# Altium project ALCT_MEZ_SPARTAN6.PrjPcb (part 1 of 5)
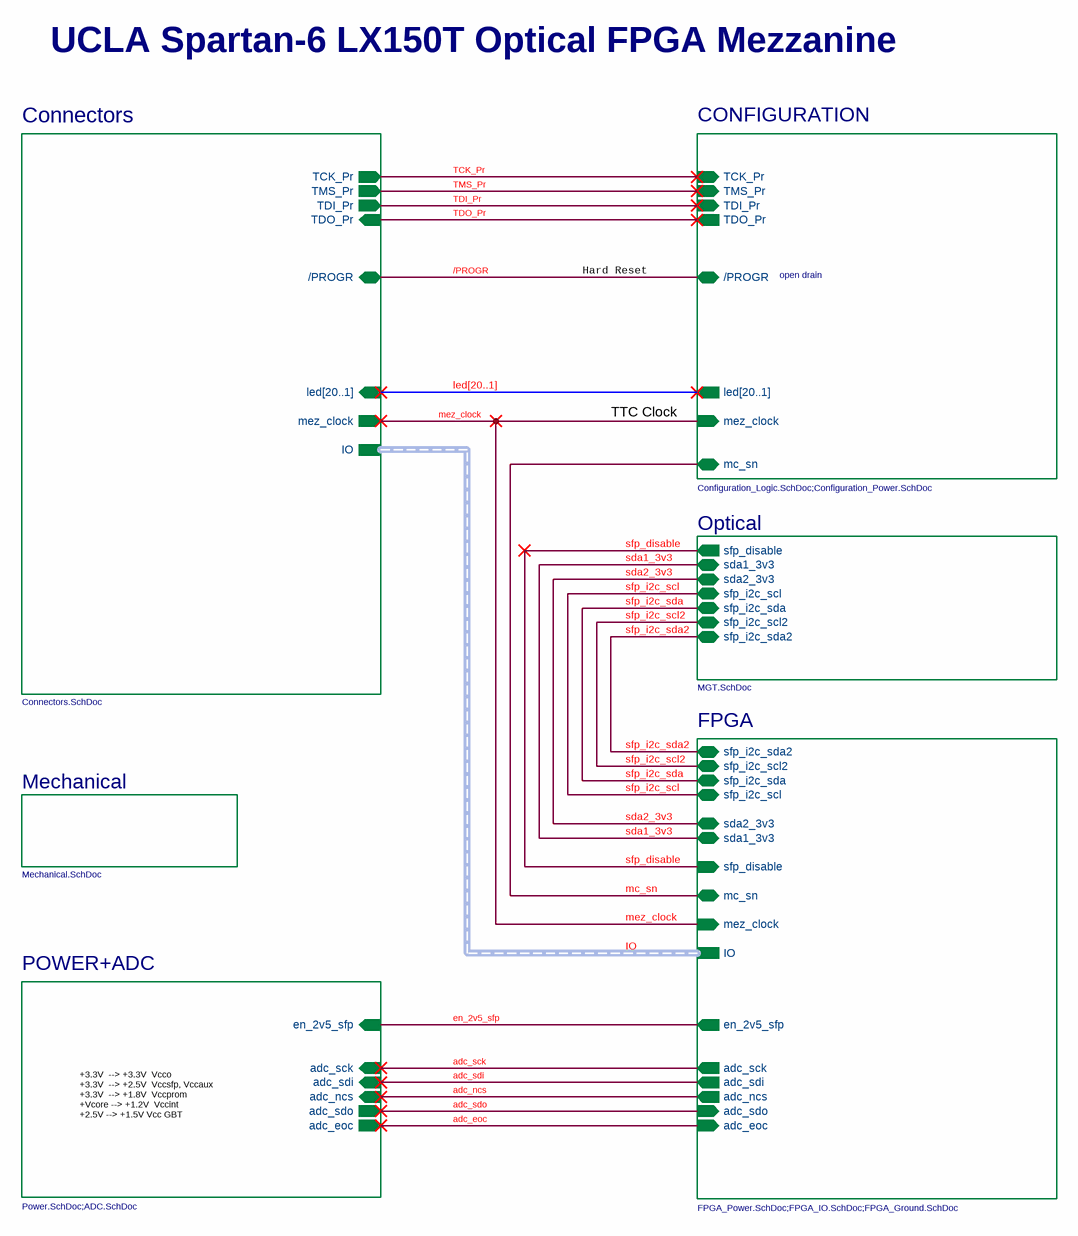
[diagram p0: ALCT2017_Logic.SchDoc]
11 sheets, 423 parts. Net scope: hierarchical (ports join the sheet entries above them; power ports are global).
Board files: ALCT_MEZ_SPARTAN6T_SI.PcbDoc, ALCT_MEZ_SPARTAN6T.PcbDoc
Sheets:
  ALCT2017_Logic.SchDoc
    Connectors = Connectors.SchDoc
    CONFIGURATION = Configuration_Logic.SchDoc
    CONFIGURATION = Configuration_Power.SchDoc
    Optical = MGT.SchDoc
      VTTX = VTTX.SchDoc
    FPGA = FPGA_Power.SchDoc
    FPGA = FPGA_Ground.SchDoc
    POWER+ADC = Power.SchDoc
    POWER+ADC = ADC.SchDoc
    Mechanical = Mechanical.SchDoc

## Sheet ALCT2017_Logic.SchDoc: Overview
size B; Organization: UCLA High Energy Physics; DocumentNumber: 1; Revision: 2.0; SheetNumber: 1; SheetTotal: 12; DocumentName: Overview; ProjectName: ALCT S-6 Optical Mezzanine

### Sub-sheets
CONFIGURATION = Configuration_Logic.SchDoc;Configuration_Power.SchDoc: TCK_Pr (in), /PROGR (bidir), TDO_Pr (out), TDI_Pr (in), TMS_Pr (in), mc_sn (bidir), mez_clock (in), led[20..1] (out)
Connectors = Connectors.SchDoc: TCK_Pr (out), TMS_Pr (out), TDI_Pr (out), TDO_Pr (in), /PROGR (bidir), mez_clock (out), IO (harness Samtec IO), led[20..1] (in)
FPGA = FPGA_Power.SchDoc;FPGA_IO.SchDoc;FPGA_Ground.SchDoc (file not in this document): mez_clock (in), adc_sck (out), adc_sdi (out), adc_ncs (out), adc_sdo (in), adc_eoc (in), IO (harness Samtec IO), mc_sn (bidir), sfp_i2c_sda2 (bidir), sfp_i2c_sda (bidir), sfp_i2c_scl (bidir), sfp_i2c_scl2 (bidir), sfp_disable (in), sda2_3v3 (bidir), sda1_3v3 (bidir), en_2v5_sfp (out)
Mechanical = Mechanical.SchDoc: no entries
Optical = MGT.SchDoc: sfp_i2c_sda2 (bidir), sfp_i2c_sda (bidir), sfp_i2c_scl (bidir), sfp_i2c_scl2 (bidir), sfp_disable (out), sda2_3v3 (bidir), sda1_3v3 (bidir)
POWER+ADC = Power.SchDoc;ADC.SchDoc: adc_sdo (out), adc_eoc (out), adc_sck (in), adc_sdi (in), adc_ncs (in), en_2v5_sfp (in)

### Nets
/PROGR: sheet Connectors//PROGR, sheet CONFIGURATION//PROGR
adc_eoc: sheet FPGA/adc_eoc, sheet POWER+ADC/adc_eoc
adc_ncs: sheet FPGA/adc_ncs, sheet POWER+ADC/adc_ncs
adc_sck: sheet FPGA/adc_sck, sheet POWER+ADC/adc_sck
adc_sdi: sheet FPGA/adc_sdi, sheet POWER+ADC/adc_sdi
adc_sdo: sheet FPGA/adc_sdo, sheet POWER+ADC/adc_sdo
en_2v5_sfp: sheet FPGA/en_2v5_sfp, sheet POWER+ADC/en_2v5_sfp
mc_sn: sheet CONFIGURATION/mc_sn, sheet FPGA/mc_sn
mez_clock: sheet Connectors/mez_clock, sheet CONFIGURATION/mez_clock, sheet FPGA/mez_clock
sda1_3v3: sheet Optical/sda1_3v3, sheet FPGA/sda1_3v3
sda2_3v3: sheet Optical/sda2_3v3, sheet FPGA/sda2_3v3
sfp_disable: sheet Optical/sfp_disable, sheet FPGA/sfp_disable
sfp_i2c_scl: sheet Optical/sfp_i2c_scl, sheet FPGA/sfp_i2c_scl
sfp_i2c_scl2: sheet Optical/sfp_i2c_scl2, sheet FPGA/sfp_i2c_scl2
sfp_i2c_sda: sheet Optical/sfp_i2c_sda, sheet FPGA/sfp_i2c_sda
sfp_i2c_sda2: sheet Optical/sfp_i2c_sda2, sheet FPGA/sfp_i2c_sda2
TCK_Pr: sheet Connectors/TCK_Pr, sheet CONFIGURATION/TCK_Pr
TDI_Pr: sheet Connectors/TDI_Pr, sheet CONFIGURATION/TDI_Pr
TDO_Pr: sheet Connectors/TDO_Pr, sheet CONFIGURATION/TDO_Pr
TMS_Pr: sheet Connectors/TMS_Pr, sheet CONFIGURATION/TMS_Pr

### Buses and harness runs
bus led[20..1] = sheet CONFIGURATION/led[20..1] = sheet Connectors/led[20..1]
harness IO = sheet Connectors/IO = sheet FPGA/IO

### Notes on the sheet
- UCLA Spartan-6 LX150T Optical FPGA Mezzanine
- Hard Reset
- open drain
- TTC Clock
- +3.3V  --> +3.3V  Vcco
  +3.3V  --> +2.5V  Vccsfp, Vccaux
  +3.3V  --> +1.8V  Vccprom
  +Vcore --> +1.2V  Vccint
  +2.5V --> +1.5V Vcc GBT
- Date:
- Rev:
- of
- Sheet

## Sheet Connectors.SchDoc: Mezzanine Connectors
size C; Organization: UCLA High Energy Physics; DocumentNumber: 2; Revision: 2.0; SheetNumber: 2; SheetTotal: 12; CurrentDate: 8/7/2018; ModifiedDate: 8/20/2018
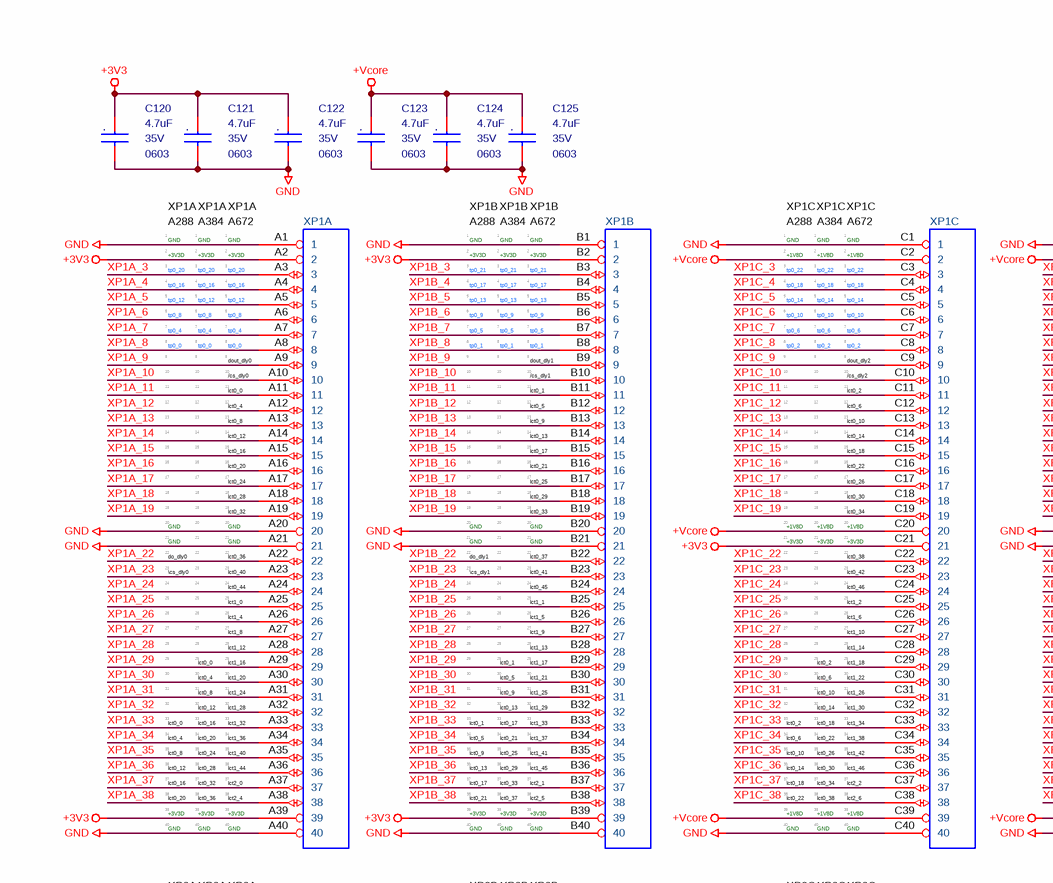
[diagram p1: Connectors.SchDoc, top left]
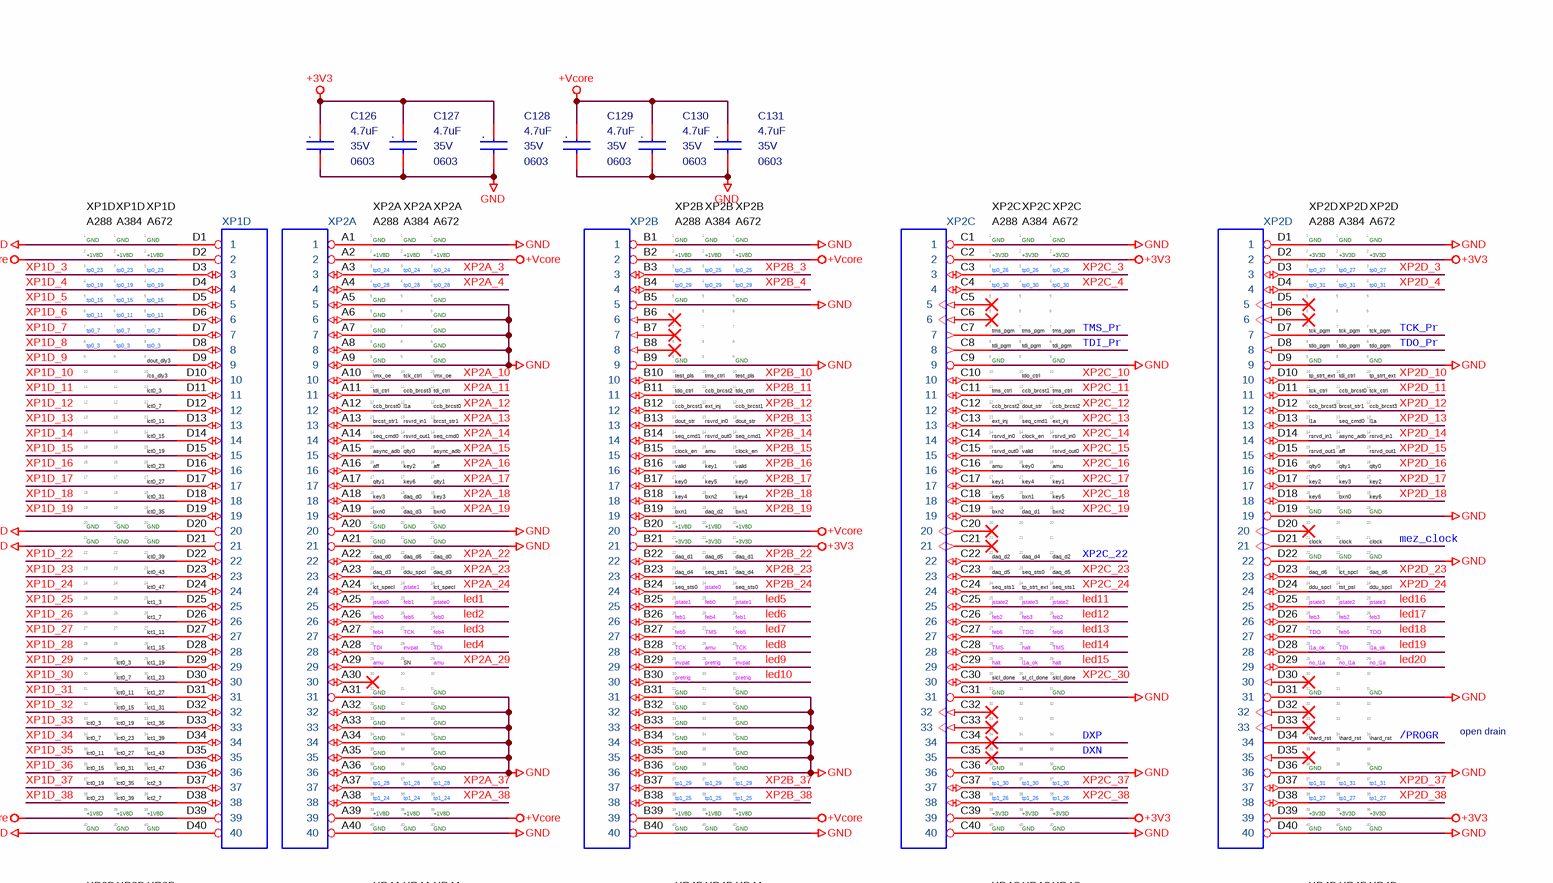
[diagram p2: Connectors.SchDoc, top right]
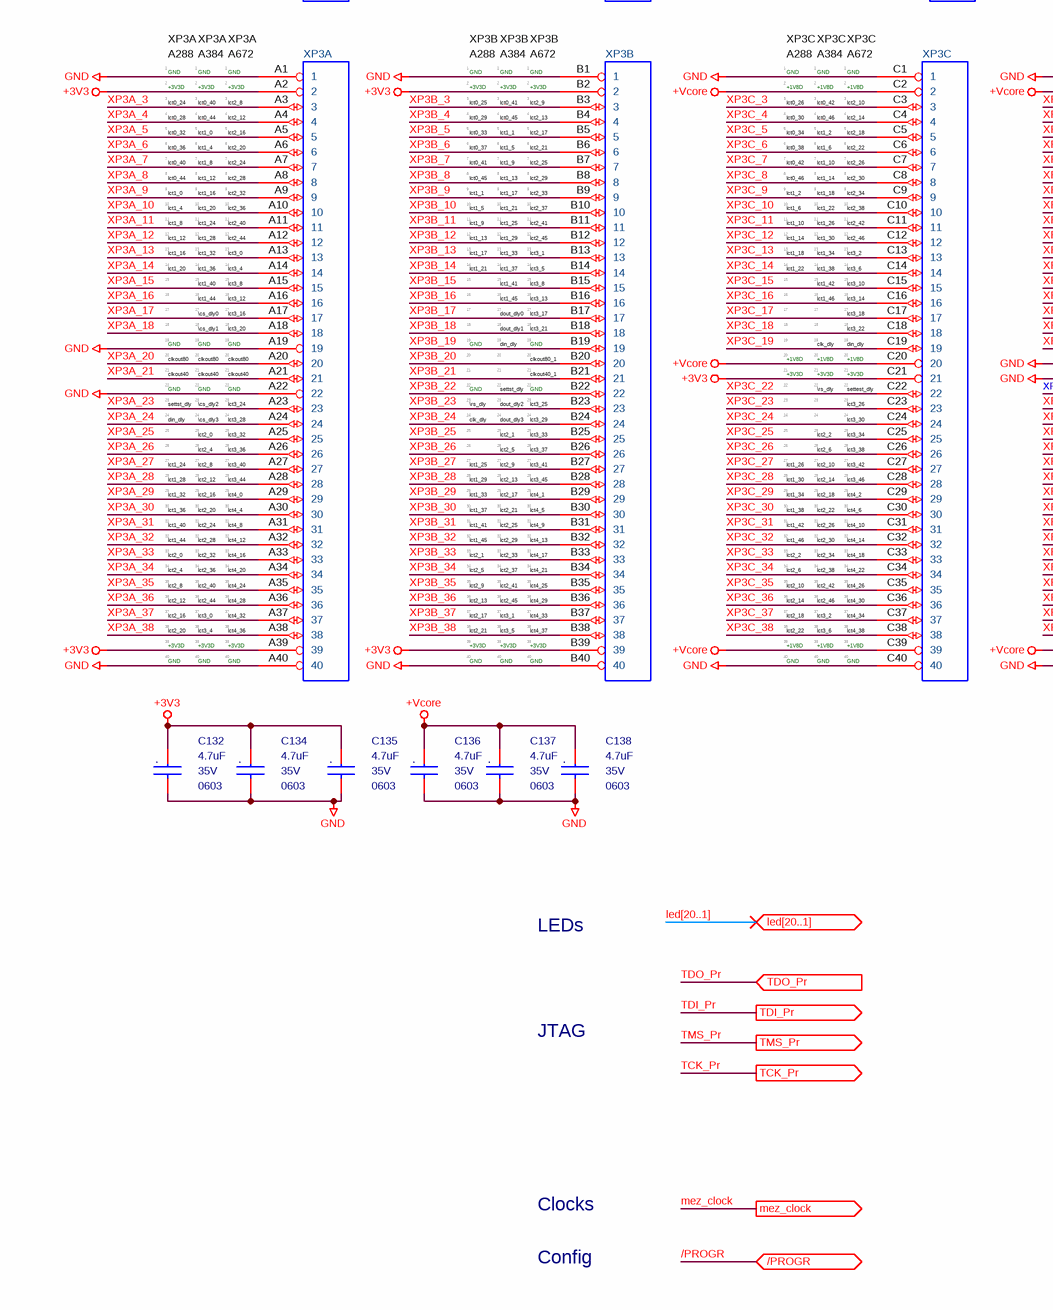
[diagram p3: Connectors.SchDoc, bottom left]
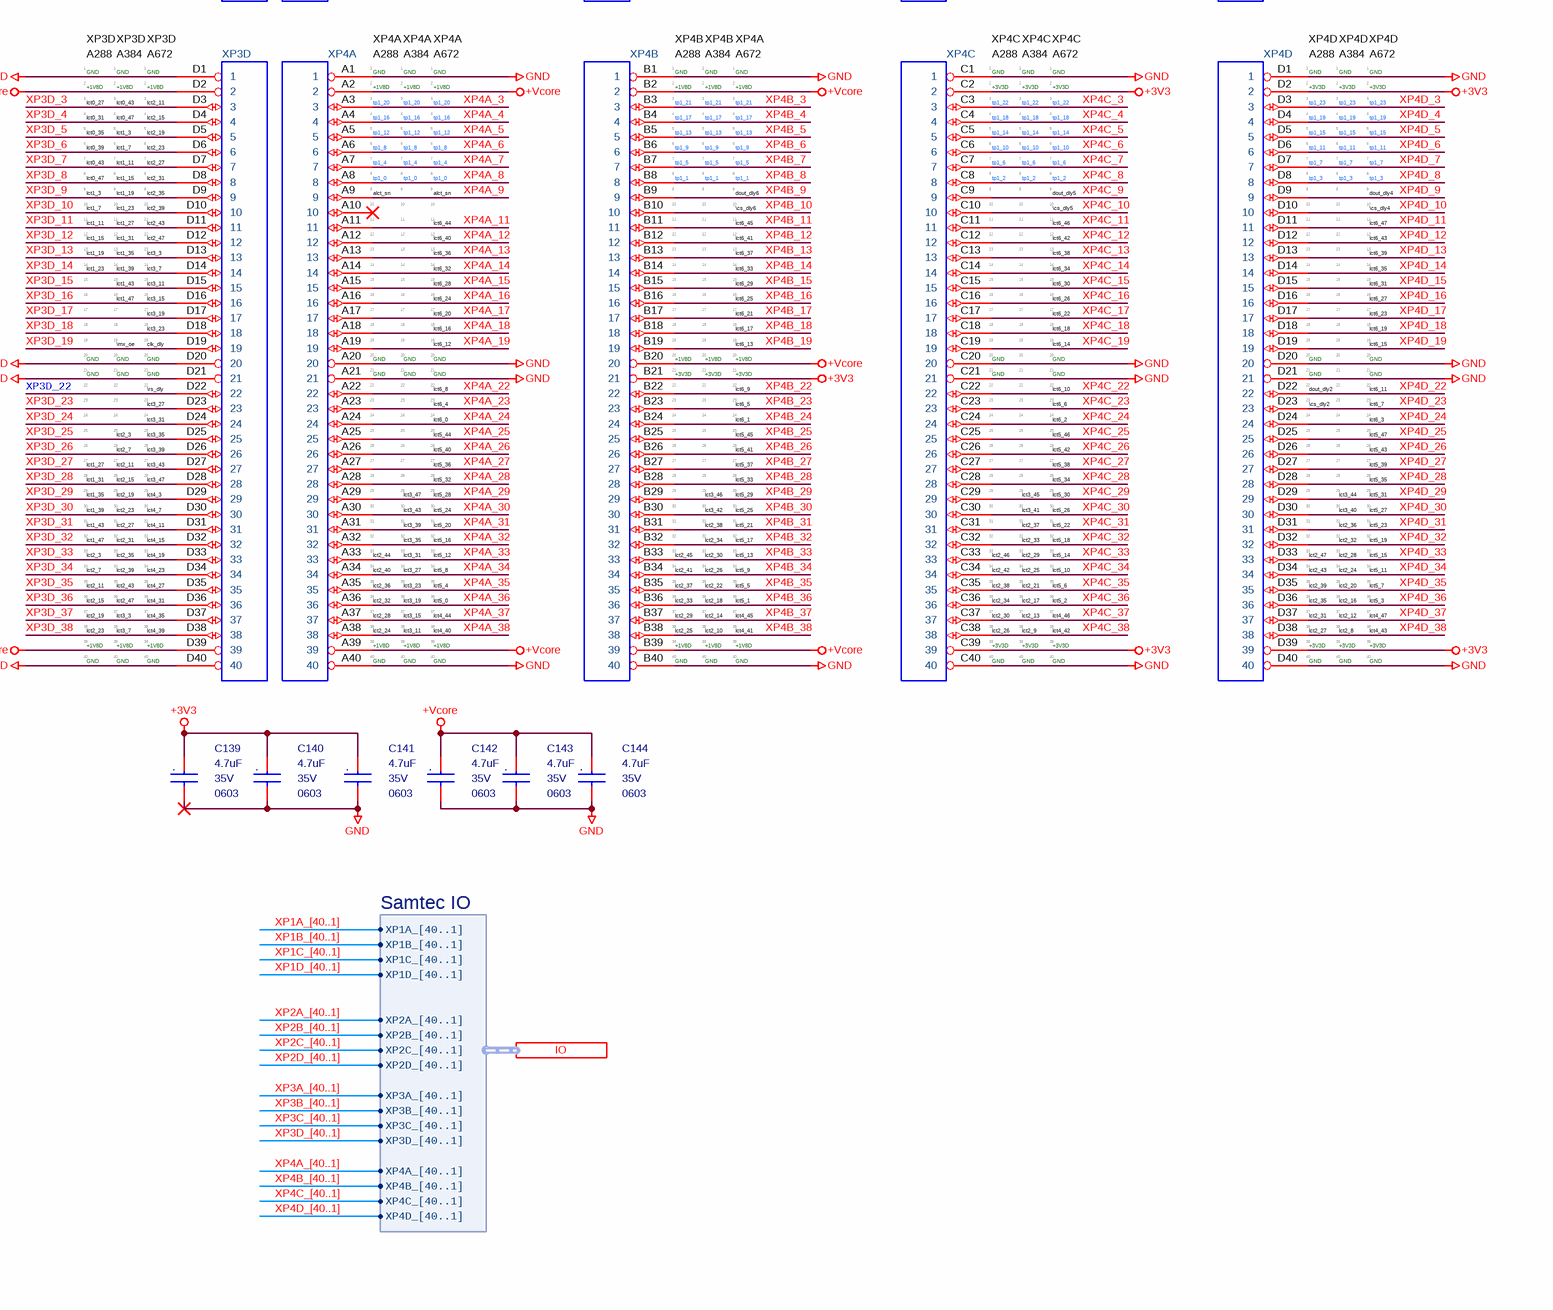
[diagram p4: Connectors.SchDoc, bottom right]

### Parts
(Parts that share a designator on the sheet are numbered #1, #2 ... from top to bottom, then left to right.)
C120  4.7uF  Voltage - Rated: 35V  package: 0603  [MC_S6/SM/C_0603_IPC]
C121  4.7uF  Voltage - Rated: 35V  package: 0603  [MC_S6/SM/C_0603_IPC]
C122  4.7uF  Voltage - Rated: 35V  package: 0603  [MC_S6/SM/C_0603_IPC]
C123  4.7uF  Voltage - Rated: 35V  package: 0603  [MC_S6/SM/C_0603_IPC]
C124  4.7uF  Voltage - Rated: 35V  package: 0603  [MC_S6/SM/C_0603_IPC]
C125  4.7uF  Voltage - Rated: 35V  package: 0603  [MC_S6/SM/C_0603_IPC]
C126  4.7uF  Voltage - Rated: 35V  package: 0603  [MC_S6/SM/C_0603_IPC]
C127  4.7uF  Voltage - Rated: 35V  package: 0603  [MC_S6/SM/C_0603_IPC]
C128  4.7uF  Voltage - Rated: 35V  package: 0603  [MC_S6/SM/C_0603_IPC]
C129  4.7uF  Voltage - Rated: 35V  package: 0603  [MC_S6/SM/C_0603_IPC]
C130  4.7uF  Voltage - Rated: 35V  package: 0603  [MC_S6/SM/C_0603_IPC]
C131  4.7uF  Voltage - Rated: 35V  package: 0603  [MC_S6/SM/C_0603_IPC]
C132  4.7uF  Voltage - Rated: 35V  package: 0603  [MC_S6/SM/C_0603_IPC]
C134  4.7uF  Voltage - Rated: 35V  package: 0603  [MC_S6/SM/C_0603_IPC]
C135  4.7uF  Voltage - Rated: 35V  package: 0603  [MC_S6/SM/C_0603_IPC]
C136  4.7uF  Voltage - Rated: 35V  package: 0603  [MC_S6/SM/C_0603_IPC]
C137  4.7uF  Voltage - Rated: 35V  package: 0603  [MC_S6/SM/C_0603_IPC]
C138  4.7uF  Voltage - Rated: 35V  package: 0603  [MC_S6/SM/C_0603_IPC]
C139  4.7uF  Voltage - Rated: 35V  package: 0603  [MC_S6/SM/C_0603_IPC]
C140  4.7uF  Voltage - Rated: 35V  package: 0603  [MC_S6/SM/C_0603_IPC]
C141  4.7uF  Voltage - Rated: 35V  package: 0603  [MC_S6/SM/C_0603_IPC]
C142  4.7uF  Voltage - Rated: 35V  package: 0603  [MC_S6/SM/C_0603_IPC]
C143  4.7uF  Voltage - Rated: 35V  package: 0603  [MC_S6/SM/C_0603_IPC]
C144  4.7uF  Voltage - Rated: 35V  package: 0603  [MC_S6/SM/C_0603_IPC]
XP1  Samtec_XP1  [MC_S6/TH/SAMTEC_MOLC_40x4]  (value not drawn)  (parts A,B,C,D of 4)
XP2  Samtec_XP2  [MC_S6/TH/SAMTEC_MOLC_40x4]  (value not drawn)  (parts A,B,C,D of 4)
XP3  Samtec_XP3  [MC_S6/TH/SAMTEC_MOLC_40x4]  (value not drawn)  (parts A,B,C,D of 4)
XP4  Samtec_XP4  [MC_S6/TH/SAMTEC_MOLC_40x4]  (value not drawn)  (parts A,B,C,D of 4)
XP?#1  A288_XP1  (value not drawn)  (part A of 4)  (graphical)
XP?#2  A384_XP1  (value not drawn)  (part A of 4)  (graphical)
XP?#3  A672_XP1  (value not drawn)  (part A of 4)  (graphical)
XP?#4  A288_XP1  (value not drawn)  (part B of 4)  (graphical)
XP?#5  A384_XP1  (value not drawn)  (part B of 4)  (graphical)
XP?#6  A672_XP1  (value not drawn)  (part B of 4)  (graphical)
XP?#7  A288_XP1  (value not drawn)  (part C of 4)  (graphical)
XP?#8  A384_XP1  (value not drawn)  (part C of 4)  (graphical)
XP?#9  A672_XP1  (value not drawn)  (part C of 4)  (graphical)
XP?#10  A288_XP1  (value not drawn)  (part D of 4)  (graphical)
XP?#11  A384_XP1  (value not drawn)  (part D of 4)  (graphical)
XP?#12  A672_XP1  (value not drawn)  (part D of 4)  (graphical)
XP?#13  A288_XP2  (value not drawn)  (part A of 4)  (graphical)
XP?#14  A384_XP2  (value not drawn)  (part A of 4)  (graphical)
XP?#15  A672_XP2  (value not drawn)  (part A of 4)  (graphical)
XP?#16  A288_XP2  (value not drawn)  (part B of 4)  (graphical)
XP?#17  A384_XP2  (value not drawn)  (part B of 4)  (graphical)
XP?#18  A672_XP2  (value not drawn)  (part B of 4)  (graphical)
XP?#19  A288_XP2  (value not drawn)  (part C of 4)  (graphical)
XP?#20  A384_XP2  (value not drawn)  (part C of 4)  (graphical)
XP?#21  A672_XP2  (value not drawn)  (part C of 4)  (graphical)
XP?#22  A288_XP2  (value not drawn)  (part D of 4)  (graphical)
XP?#23  A384_XP2  (value not drawn)  (part D of 4)  (graphical)
XP?#24  A672_XP2  (value not drawn)  (part D of 4)  (graphical)
XP?#25  A288_XP3  (value not drawn)  (part A of 4)  (graphical)
XP?#26  A384_XP3  (value not drawn)  (part A of 4)  (graphical)
XP?#27  A672_XP3  (value not drawn)  (part A of 4)  (graphical)
XP?#28  A288_XP3  (value not drawn)  (part B of 4)  (graphical)
XP?#29  A384_XP3  (value not drawn)  (part B of 4)  (graphical)
XP?#30  A672_XP3  (value not drawn)  (part B of 4)  (graphical)
XP?#31  A288_XP3  (value not drawn)  (part C of 4)  (graphical)
XP?#32  A384_XP3  (value not drawn)  (part C of 4)  (graphical)
XP?#33  A672_XP3  (value not drawn)  (part C of 4)  (graphical)
XP?#34  A288_XP3  (value not drawn)  (part D of 4)  (graphical)
XP?#35  A384_XP3  (value not drawn)  (part D of 4)  (graphical)
XP?#36  A672_XP3  (value not drawn)  (part D of 4)  (graphical)
XP?#37  A288_XP4  (value not drawn)  (part A of 4)  (graphical)
XP?#38  A384_XP4  (value not drawn)  (part A of 4)  (graphical)
XP?#39  A672_XP4  (value not drawn)  (part A of 4)  (graphical)
XP?#40  A288_XP4  (value not drawn)  (part B of 4)  (graphical)
XP?#41  A384_XP4  (value not drawn)  (part B of 4)  (graphical)
XP?#42  A672_XP4  (value not drawn)  (part B of 4)  (graphical)
XP?#43  A288_XP4  (value not drawn)  (part C of 4)  (graphical)
XP?#44  A384_XP4  (value not drawn)  (part C of 4)  (graphical)
XP?#45  A672_XP4  (value not drawn)  (part C of 4)  (graphical)
XP?#46  A288_XP4  (value not drawn)  (part D of 4)  (graphical)
XP?#47  A384_XP4  (value not drawn)  (part D of 4)  (graphical)
XP?#48  A672_XP4  (value not drawn)  (part D of 4)  (graphical)

### Ports
/PROGR (bidir), IO (harness Samtec IO), led[20..1] (bidir), mez_clock (out), TCK_Pr (out), TDI_Pr (out), TDO_Pr (in), TMS_Pr (out)

### Harnesses
Samtec IO: XP1A_[40..1], XP1B_[40..1], XP1C_[40..1], XP1D_[40..1], XP2A_[40..1], XP2B_[40..1], XP2C_[40..1], XP2D_[40..1], XP3A_[40..1], XP3B_[40..1], XP3C_[40..1], XP3D_[40..1], XP4A_[40..1], XP4B_[40..1], XP4C_[40..1], XP4D_[40..1]

### Nets
+3V3: C120.1 C121.1 C122.1 C126.1 C127.1 C128.1 C132.1 C134.1 C135.1 C139.1 C140.1 C141.1 XP1.A2(2) XP1.A39(39) XP1.B2(2) XP1.B39(39) XP1.C21(21) XP2.B21(21) XP2.C2(2) XP2.C39(39) XP2.D2(2) XP2.D39(39) XP3.A2(2) XP3.A39(39) XP3.B2(2) XP3.B39(39) XP3.C21(21) XP4.B21(21) XP4.C2(2) XP4.C39(39) XP4.D2(2) XP4.D39(39)
+Vcore: C123.1 C124.1 C125.1 C129.1 C130.1 C131.1 C136.1 C137.1 C138.1 C142.1 C143.1 C144.1 XP1.C2(2) XP1.C20(20) XP1.C39(39) XP1.D2(2) XP1.D39(39) XP2.A2(2) XP2.A39(39) XP2.B2(2) XP2.B20(20) XP2.B39(39) XP3.C2(2) XP3.C20(20) XP3.C39(39) XP3.D2(2) XP3.D39(39) XP4.A2(2) XP4.A39(39) XP4.B2(2) XP4.B20(20) XP4.B39(39)
GND: C120.2 C121.2 C122.2 C123.2 C124.2 C125.2 C126.2 C127.2 C128.2 C129.2 C130.2 C131.2 C132.2 C134.2 C135.2 C136.2 C137.2 C138.2 C139.2 C140.2 C141.2 C142.2 C143.2 C144.2 XP1.A1(1) XP1.A20(20) XP1.A21(21) XP1.A40(40) XP1.B1(1) XP1.B20(20) XP1.B21(21) XP1.B40(40) XP1.C1(1) XP1.C40(40) XP1.D1(1) XP1.D20(20) XP1.D21(21) XP1.D40(40) XP2.A1(1) XP2.A5(5) XP2.A6(6) XP2.A7(7) XP2.A8(8) XP2.A9(9) XP2.A20(20) XP2.A21(21) XP2.A31(31) XP2.A32(32) XP2.A33(33) XP2.A34(34) XP2.A35(35) XP2.A36(36) XP2.A40(40) XP2.B1(1) XP2.B5(5) XP2.B9(9) XP2.B31(31) XP2.B32(32) XP2.B33(33) XP2.B34(34) XP2.B35(35) XP2.B36(36) XP2.B40(40) XP2.C1(1) XP2.C9(9) XP2.C31(31) XP2.C36(36) XP2.C40(40) XP2.D1(1) XP2.D9(9) XP2.D19(19) XP2.D22(22) XP2.D31(31) XP2.D36(36) XP2.D40(40) XP3.A1(1) XP3.A19(19) XP3.A22(22) XP3.A40(40) XP3.B1(1) XP3.B40(40) XP3.C1(1) XP3.C40(40) XP3.D1(1) XP3.D20(20) XP3.D21(21) XP3.D40(40) XP4.A1(1) XP4.A20(20) XP4.A21(21) XP4.A40(40) XP4.B1(1) XP4.B40(40) XP4.C1(1) XP4.C20(20) XP4.C21(21) XP4.C40(40) XP4.D1(1) XP4.D20(20) XP4.D21(21) XP4.D40(40)
/PROGR: XP2.D34(34) ; port /PROGR
DXN: XP2.C35(35)
DXP: XP2.C34(34)
led1: XP2.A25(25)
led2: XP2.A26(26)
led3: XP2.A27(27)
led4: XP2.A28(28)
led5: XP2.B25(25)
led6: XP2.B26(26)
led7: XP2.B27(27)
led8: XP2.B28(28)
led9: XP2.B29(29)
led10: XP2.B30(30)
led11: XP2.C25(25)
led12: XP2.C26(26)
led13: XP2.C27(27)
led14: XP2.C28(28)
led15: XP2.C29(29)
led16: XP2.D25(25)
led17: XP2.D26(26)
led18: XP2.D27(27)
led19: XP2.D28(28)
led20: XP2.D29(29)
mez_clock: XP2.D21(21) ; port mez_clock
TCK_Pr: XP2.D7(7) ; port TCK_Pr
TDI_Pr: XP2.C8(8) ; port TDI_Pr
TDO_Pr: XP2.D8(8) ; port TDO_Pr
TMS_Pr: XP2.C7(7) ; port TMS_Pr
XP1A_3: XP1.A3(3)
XP1A_4: XP1.A4(4)
XP1A_5: XP1.A5(5)
XP1A_6: XP1.A6(6)
XP1A_7: XP1.A7(7)
XP1A_8: XP1.A8(8)
XP1A_9: XP1.A9(9)
XP1A_10: XP1.A10(10)
XP1A_11: XP1.A11(11)
XP1A_12: XP1.A12(12)
XP1A_13: XP1.A13(13)
XP1A_14: XP1.A14(14)
XP1A_15: XP1.A15(15)
XP1A_16: XP1.A16(16)
XP1A_17: XP1.A17(17)
XP1A_18: XP1.A18(18)
XP1A_19: XP1.A19(19)
XP1A_22: XP1.A22(22)
XP1A_23: XP1.A23(23)
XP1A_24: XP1.A24(24)
XP1A_25: XP1.A25(25)
XP1A_26: XP1.A26(26)
XP1A_27: XP1.A27(27)
XP1A_28: XP1.A28(28)
XP1A_29: XP1.A29(29)
XP1A_30: XP1.A30(30)
XP1A_31: XP1.A31(31)
XP1A_32: XP1.A32(32)
XP1A_33: XP1.A33(33)
XP1A_34: XP1.A34(34)
XP1A_35: XP1.A35(35)
XP1A_36: XP1.A36(36)
XP1A_37: XP1.A37(37)
XP1A_38: XP1.A38(38)
XP1B_3: XP1.B3(3)
XP1B_4: XP1.B4(4)
XP1B_5: XP1.B5(5)
XP1B_6: XP1.B6(6)
XP1B_7: XP1.B7(7)
XP1B_8: XP1.B8(8)
XP1B_9: XP1.B9(9)
XP1B_10: XP1.B10(10)
XP1B_11: XP1.B11(11)
XP1B_12: XP1.B12(12)
XP1B_13: XP1.B13(13)
XP1B_14: XP1.B14(14)
XP1B_15: XP1.B15(15)
XP1B_16: XP1.B16(16)
XP1B_17: XP1.B17(17)
XP1B_18: XP1.B18(18)
XP1B_19: XP1.B19(19)
XP1B_22: XP1.B22(22)
XP1B_23: XP1.B23(23)
XP1B_24: XP1.B24(24)
XP1B_25: XP1.B25(25)
XP1B_26: XP1.B26(26)
XP1B_27: XP1.B27(27)
XP1B_28: XP1.B28(28)
XP1B_29: XP1.B29(29)
XP1B_30: XP1.B30(30)
XP1B_31: XP1.B31(31)
XP1B_32: XP1.B32(32)
XP1B_33: XP1.B33(33)
XP1B_34: XP1.B34(34)
XP1B_35: XP1.B35(35)
XP1B_36: XP1.B36(36)
XP1B_37: XP1.B37(37)
XP1B_38: XP1.B38(38)
XP1C_3: XP1.C3(3)
XP1C_4: XP1.C4(4)
XP1C_5: XP1.C5(5)
XP1C_6: XP1.C6(6)
XP1C_7: XP1.C7(7)
XP1C_8: XP1.C8(8)
XP1C_9: XP1.C9(9)
XP1C_10: XP1.C10(10)
XP1C_11: XP1.C11(11)
XP1C_12: XP1.C12(12)
XP1C_13: XP1.C13(13)
XP1C_14: XP1.C14(14)
XP1C_15: XP1.C15(15)
XP1C_16: XP1.C16(16)
XP1C_17: XP1.C17(17)
XP1C_18: XP1.C18(18)
XP1C_19: XP1.C19(19)
XP1C_22: XP1.C22(22)
XP1C_23: XP1.C23(23)
XP1C_24: XP1.C24(24)
XP1C_25: XP1.C25(25)
XP1C_26: XP1.C26(26)
XP1C_27: XP1.C27(27)
XP1C_28: XP1.C28(28)
XP1C_29: XP1.C29(29)
XP1C_30: XP1.C30(30)
XP1C_31: XP1.C31(31)
XP1C_32: XP1.C32(32)
XP1C_33: XP1.C33(33)
XP1C_34: XP1.C34(34)
XP1C_35: XP1.C35(35)
XP1C_36: XP1.C36(36)
XP1C_37: XP1.C37(37)
XP1C_38: XP1.C38(38)
XP1D_3: XP1.D3(3)
XP1D_4: XP1.D4(4)
XP1D_5: XP1.D5(5)
XP1D_6: XP1.D6(6)
XP1D_7: XP1.D7(7)
XP1D_8: XP1.D8(8)
XP1D_9: XP1.D9(9)
XP1D_10: XP1.D10(10)
XP1D_11: XP1.D11(11)
XP1D_12: XP1.D12(12)
XP1D_13: XP1.D13(13)
XP1D_14: XP1.D14(14)
XP1D_15: XP1.D15(15)
XP1D_16: XP1.D16(16)
XP1D_17: XP1.D17(17)
XP1D_18: XP1.D18(18)
XP1D_19: XP1.D19(19)
XP1D_22: XP1.D22(22)
XP1D_23: XP1.D23(23)
XP1D_24: XP1.D24(24)
XP1D_25: XP1.D25(25)
XP1D_26: XP1.D26(26)
XP1D_27: XP1.D27(27)
XP1D_28: XP1.D28(28)
XP1D_29: XP1.D29(29)
XP1D_30: XP1.D30(30)
XP1D_31: XP1.D31(31)
XP1D_32: XP1.D32(32)
XP1D_33: XP1.D33(33)
XP1D_34: XP1.D34(34)
XP1D_35: XP1.D35(35)
XP1D_36: XP1.D36(36)
XP1D_37: XP1.D37(37)
XP1D_38: XP1.D38(38)
XP2A_3: XP2.A3(3)
XP2A_4: XP2.A4(4)
XP2A_10: XP2.A10(10)
XP2A_11: XP2.A11(11)
XP2A_12: XP2.A12(12)
XP2A_13: XP2.A13(13)
XP2A_14: XP2.A14(14)
XP2A_15: XP2.A15(15)
XP2A_16: XP2.A16(16)
XP2A_17: XP2.A17(17)
XP2A_18: XP2.A18(18)
XP2A_19: XP2.A19(19)
XP2A_22: XP2.A22(22)
XP2A_23: XP2.A23(23)
XP2A_24: XP2.A24(24)
XP2A_29: XP2.A29(29)
XP2A_37: XP2.A37(37)
XP2A_38: XP2.A38(38)
XP2B_3: XP2.B3(3)
XP2B_4: XP2.B4(4)
XP2B_10: XP2.B10(10)
XP2B_11: XP2.B11(11)
XP2B_12: XP2.B12(12)
XP2B_13: XP2.B13(13)
XP2B_14: XP2.B14(14)
XP2B_15: XP2.B15(15)
XP2B_16: XP2.B16(16)
XP2B_17: XP2.B17(17)
XP2B_18: XP2.B18(18)
XP2B_19: XP2.B19(19)
XP2B_22: XP2.B22(22)
XP2B_23: XP2.B23(23)
XP2B_24: XP2.B24(24)
XP2B_37: XP2.B37(37)
XP2B_38: XP2.B38(38)
XP2C_3: XP2.C3(3)
XP2C_4: XP2.C4(4)
XP2C_10: XP2.C10(10)
XP2C_11: XP2.C11(11)
XP2C_12: XP2.C12(12)
XP2C_13: XP2.C13(13)
XP2C_14: XP2.C14(14)
XP2C_15: XP2.C15(15)
XP2C_16: XP2.C16(16)
XP2C_17: XP2.C17(17)
XP2C_18: XP2.C18(18)
XP2C_19: XP2.C19(19)
XP2C_22: XP2.C22(22)
XP2C_23: XP2.C23(23)
XP2C_24: XP2.C24(24)
XP2C_30: XP2.C30(30)
XP2C_37: XP2.C37(37)
XP2C_38: XP2.C38(38)
XP2D_3: XP2.D3(3)
XP2D_4: XP2.D4(4)
XP2D_10: XP2.D10(10)
XP2D_11: XP2.D11(11)
XP2D_12: XP2.D12(12)
XP2D_13: XP2.D13(13)
XP2D_14: XP2.D14(14)
XP2D_15: XP2.D15(15)
XP2D_16: XP2.D16(16)
XP2D_17: XP2.D17(17)
XP2D_18: XP2.D18(18)
XP2D_23: XP2.D23(23)
XP2D_24: XP2.D24(24)
XP2D_37: XP2.D37(37)
XP2D_38: XP2.D38(38)
XP3A_3: XP3.A3(3)
XP3A_4: XP3.A4(4)
XP3A_5: XP3.A5(5)
XP3A_6: XP3.A6(6)
XP3A_7: XP3.A7(7)
XP3A_8: XP3.A8(8)
XP3A_9: XP3.A9(9)
XP3A_10: XP3.A10(10)
XP3A_11: XP3.A11(11)
XP3A_12: XP3.A12(12)
XP3A_13: XP3.A13(13)
XP3A_14: XP3.A14(14)
XP3A_15: XP3.A15(15)
XP3A_16: XP3.A16(16)
XP3A_17: XP3.A17(17)
XP3A_18: XP3.A18(18)
XP3A_20: XP3.A20(20)
XP3A_21: XP3.A21(21)
XP3A_23: XP3.A23(23)
XP3A_24: XP3.A24(24)
XP3A_25: XP3.A25(25)
XP3A_26: XP3.A26(26)
XP3A_27: XP3.A27(27)
XP3A_28: XP3.A28(28)
XP3A_29: XP3.A29(29)
XP3A_30: XP3.A30(30)
XP3A_31: XP3.A31(31)
XP3A_32: XP3.A32(32)
XP3A_33: XP3.A33(33)
XP3A_34: XP3.A34(34)
XP3A_35: XP3.A35(35)
XP3A_36: XP3.A36(36)
XP3A_37: XP3.A37(37)
XP3A_38: XP3.A38(38)
XP3B_3: XP3.B3(3)
XP3B_4: XP3.B4(4)
XP3B_5: XP3.B5(5)
XP3B_6: XP3.B6(6)
XP3B_7: XP3.B7(7)
XP3B_8: XP3.B8(8)
XP3B_9: XP3.B9(9)
XP3B_10: XP3.B10(10)
XP3B_11: XP3.B11(11)
XP3B_12: XP3.B12(12)
XP3B_13: XP3.B13(13)
XP3B_14: XP3.B14(14)
XP3B_15: XP3.B15(15)
XP3B_16: XP3.B16(16)
XP3B_17: XP3.B17(17)
XP3B_18: XP3.B18(18)
XP3B_19: XP3.B19(19)
XP3B_20: XP3.B20(20)
XP3B_21: XP3.B21(21)
XP3B_22: XP3.B22(22)
XP3B_23: XP3.B23(23)
XP3B_24: XP3.B24(24)
XP3B_25: XP3.B25(25)
XP3B_26: XP3.B26(26)
XP3B_27: XP3.B27(27)
XP3B_28: XP3.B28(28)
XP3B_29: XP3.B29(29)
XP3B_30: XP3.B30(30)
XP3B_31: XP3.B31(31)
XP3B_32: XP3.B32(32)
XP3B_33: XP3.B33(33)
XP3B_34: XP3.B34(34)
XP3B_35: XP3.B35(35)
XP3B_36: XP3.B36(36)
XP3B_37: XP3.B37(37)
XP3B_38: XP3.B38(38)
XP3C_3: XP3.C3(3)
XP3C_4: XP3.C4(4)
XP3C_5: XP3.C5(5)
XP3C_6: XP3.C6(6)
XP3C_7: XP3.C7(7)
XP3C_8: XP3.C8(8)
XP3C_9: XP3.C9(9)
XP3C_10: XP3.C10(10)
XP3C_11: XP3.C11(11)
XP3C_12: XP3.C12(12)
XP3C_13: XP3.C13(13)
XP3C_14: XP3.C14(14)
XP3C_15: XP3.C15(15)
XP3C_16: XP3.C16(16)
XP3C_17: XP3.C17(17)
XP3C_18: XP3.C18(18)
XP3C_19: XP3.C19(19)
XP3C_22: XP3.C22(22)
XP3C_23: XP3.C23(23)
XP3C_24: XP3.C24(24)
XP3C_25: XP3.C25(25)
XP3C_26: XP3.C26(26)
XP3C_27: XP3.C27(27)
XP3C_28: XP3.C28(28)
XP3C_29: XP3.C29(29)
XP3C_30: XP3.C30(30)
XP3C_31: XP3.C31(31)
XP3C_32: XP3.C32(32)
XP3C_33: XP3.C33(33)
XP3C_34: XP3.C34(34)
XP3C_35: XP3.C35(35)
XP3C_36: XP3.C36(36)
XP3C_37: XP3.C37(37)
XP3C_38: XP3.C38(38)
XP3D_3: XP3.D3(3)
XP3D_4: XP3.D4(4)
XP3D_5: XP3.D5(5)
XP3D_6: XP3.D6(6)
XP3D_7: XP3.D7(7)
XP3D_8: XP3.D8(8)
XP3D_9: XP3.D9(9)
XP3D_10: XP3.D10(10)
XP3D_11: XP3.D11(11)
XP3D_12: XP3.D12(12)
XP3D_13: XP3.D13(13)
XP3D_14: XP3.D14(14)
XP3D_15: XP3.D15(15)
XP3D_16: XP3.D16(16)
XP3D_17: XP3.D17(17)
XP3D_18: XP3.D18(18)
XP3D_19: XP3.D19(19)
XP3D_22: XP3.D22(22)
XP3D_23: XP3.D23(23)
XP3D_24: XP3.D24(24)
XP3D_25: XP3.D25(25)
XP3D_26: XP3.D26(26)
XP3D_27: XP3.D27(27)
XP3D_28: XP3.D28(28)
XP3D_29: XP3.D29(29)
XP3D_30: XP3.D30(30)
XP3D_31: XP3.D31(31)
XP3D_32: XP3.D32(32)
XP3D_33: XP3.D33(33)
XP3D_34: XP3.D34(34)
XP3D_35: XP3.D35(35)
XP3D_36: XP3.D36(36)
XP3D_37: XP3.D37(37)
XP3D_38: XP3.D38(38)
XP4A_3: XP4.A3(3)
XP4A_4: XP4.A4(4)
XP4A_5: XP4.A5(5)
XP4A_6: XP4.A6(6)
XP4A_7: XP4.A7(7)
XP4A_8: XP4.A8(8)
XP4A_9: XP4.A9(9)
XP4A_11: XP4.A11(11)
XP4A_12: XP4.A12(12)
XP4A_13: XP4.A13(13)
XP4A_14: XP4.A14(14)
XP4A_15: XP4.A15(15)
XP4A_16: XP4.A16(16)
XP4A_17: XP4.A17(17)
XP4A_18: XP4.A18(18)
XP4A_19: XP4.A19(19)
XP4A_22: XP4.A22(22)
XP4A_23: XP4.A23(23)
XP4A_24: XP4.A24(24)
XP4A_25: XP4.A25(25)
XP4A_26: XP4.A26(26)
XP4A_27: XP4.A27(27)
XP4A_28: XP4.A28(28)
XP4A_29: XP4.A29(29)
XP4A_30: XP4.A30(30)
XP4A_31: XP4.A31(31)
XP4A_32: XP4.A32(32)
XP4A_33: XP4.A33(33)
XP4A_34: XP4.A34(34)
XP4A_35: XP4.A35(35)
XP4A_36: XP4.A36(36)
XP4A_37: XP4.A37(37)
XP4A_38: XP4.A38(38)
XP4B_3: XP4.B3(3)
XP4B_4: XP4.B4(4)
XP4B_5: XP4.B5(5)
XP4B_6: XP4.B6(6)
XP4B_7: XP4.B7(7)
XP4B_8: XP4.B8(8)
XP4B_9: XP4.B9(9)
XP4B_10: XP4.B10(10)
XP4B_11: XP4.B11(11)
XP4B_12: XP4.B12(12)
XP4B_13: XP4.B13(13)
XP4B_14: XP4.B14(14)
XP4B_15: XP4.B15(15)
XP4B_16: XP4.B16(16)
XP4B_17: XP4.B17(17)
XP4B_18: XP4.B18(18)
XP4B_19: XP4.B19(19)
XP4B_22: XP4.B22(22)
XP4B_23: XP4.B23(23)
XP4B_24: XP4.B24(24)
XP4B_25: XP4.B25(25)
XP4B_26: XP4.B26(26)
XP4B_27: XP4.B27(27)
XP4B_28: XP4.B28(28)
XP4B_29: XP4.B29(29)
XP4B_30: XP4.B30(30)
XP4B_31: XP4.B31(31)
XP4B_32: XP4.B32(32)
XP4B_33: XP4.B33(33)
XP4B_34: XP4.B34(34)
XP4B_35: XP4.B35(35)
XP4B_36: XP4.B36(36)
XP4B_37: XP4.B37(37)
XP4B_38: XP4.B38(38)
XP4C_3: XP4.C3(3)
XP4C_4: XP4.C4(4)
XP4C_5: XP4.C5(5)
XP4C_6: XP4.C6(6)
XP4C_7: XP4.C7(7)
XP4C_8: XP4.C8(8)
XP4C_9: XP4.C9(9)
XP4C_10: XP4.C10(10)
XP4C_11: XP4.C11(11)
XP4C_12: XP4.C12(12)
XP4C_13: XP4.C13(13)
XP4C_14: XP4.C14(14)
XP4C_15: XP4.C15(15)
XP4C_16: XP4.C16(16)
XP4C_17: XP4.C17(17)
XP4C_18: XP4.C18(18)
XP4C_19: XP4.C19(19)
XP4C_22: XP4.C22(22)
XP4C_23: XP4.C23(23)
XP4C_24: XP4.C24(24)
XP4C_25: XP4.C25(25)
XP4C_26: XP4.C26(26)
XP4C_27: XP4.C27(27)
XP4C_28: XP4.C28(28)
XP4C_29: XP4.C29(29)
XP4C_30: XP4.C30(30)
XP4C_31: XP4.C31(31)
XP4C_32: XP4.C32(32)
XP4C_33: XP4.C33(33)
XP4C_34: XP4.C34(34)
XP4C_35: XP4.C35(35)
XP4C_36: XP4.C36(36)
XP4C_37: XP4.C37(37)
XP4C_38: XP4.C38(38)
XP4D_3: XP4.D3(3)
XP4D_4: XP4.D4(4)
XP4D_5: XP4.D5(5)
XP4D_6: XP4.D6(6)
XP4D_7: XP4.D7(7)
XP4D_8: XP4.D8(8)
XP4D_9: XP4.D9(9)
XP4D_10: XP4.D10(10)
XP4D_11: XP4.D11(11)
XP4D_12: XP4.D12(12)
XP4D_13: XP4.D13(13)
XP4D_14: XP4.D14(14)
XP4D_15: XP4.D15(15)
XP4D_16: XP4.D16(16)
XP4D_17: XP4.D17(17)
XP4D_18: XP4.D18(18)
XP4D_19: XP4.D19(19)
XP4D_22: XP4.D22(22)
XP4D_23: XP4.D23(23)
XP4D_24: XP4.D24(24)
XP4D_25: XP4.D25(25)
XP4D_26: XP4.D26(26)
XP4D_27: XP4.D27(27)
XP4D_28: XP4.D28(28)
XP4D_29: XP4.D29(29)
XP4D_30: XP4.D30(30)
XP4D_31: XP4.D31(31)
XP4D_32: XP4.D32(32)
XP4D_33: XP4.D33(33)
XP4D_34: XP4.D34(34)
XP4D_35: XP4.D35(35)
XP4D_36: XP4.D36(36)
XP4D_37: XP4.D37(37)
XP4D_38: XP4.D38(38)

Not connected (* = marked no-connect by the designer): XP2 A30(30)* B6(6)* B7(7)* B8(8)* C5(5)* C6(6)* C20(20)* C21(21)* C32(32)* C33(33)* D5(5)* D6(6)* D20(20)* D30(30)* D32(32)* D33(33)* D35(35)*; XP4 A10(10)*

### Buses and harness runs
bus led[20..1] = port led[20..1]
bus XP1A_[40..1]
bus XP1B_[40..1]
bus XP1C_[40..1]
bus XP1D_[40..1]
bus XP2A_[40..1]
bus XP2B_[40..1]
bus XP2C_[40..1]
bus XP2D_[40..1]
bus XP3A_[40..1]
bus XP3B_[40..1]
bus XP3C_[40..1]
bus XP3D_[40..1]
bus XP4A_[40..1]
bus XP4B_[40..1]
bus XP4C_[40..1]
bus XP4D_[40..1]

### Notes on the sheet
- open drain
- LEDs
- JTAG
- Config
- Clocks
- Date:
- Rev:
- Sheet
- of
- (in symbol A288_XP1, part A) XP1A; A288; 1; GND; 2; +3V3D; 3; tp0_20; 4; tp0_16; 5; tp0_12; 6; tp0_8; 7; tp0_4; 8; tp0_0; 9; 10; 11; 12; 13; 14; 15; 16; 17; 18; 19; 20; 21; 22; do_dly0; 23; \cs_dly0; 24; 25; 26; 27; 28; 29; 30; 31; 32; 33; lct0_0; 34; lct0_4; 35; lct0_8; 36; lct0_12; 37; lct0_16; 38; lct0_20; 39; 40
- (in symbol A288_XP1, part B) XP1B; A288; 1; GND; 2; +3V3D; 3; tp0_21; 4; tp0_17; 5; tp0_13; 6; tp0_9; 7; tp0_5; 8; tp0_1; 9; 10; 11; 12; 13; 14; 15; 16; 17; 18; 19; 20; 21; 22; do_dly1; 23; \cs_dly1; 24; 25; 26; 27; 28; 29; 30; 31; 32; 33; lct0_1; 34; lct0_5; 35; lct0_9; 36; lct0_13; 37; lct0_17; 38; lct0_21; 39; 40
- (in symbol A288_XP1, part C) XP1C; A288; 1; GND; 2; +1V8D; 3; tp0_22; 4; tp0_18; 5; tp0_14; 6; tp0_10; 7; tp0_6; 8; tp0_2; 9; 10; 11; 12; 13; 14; 15; 16; 17; 18; 19; 20; 21; +3V3D; 22; 23; 24; 25; 26; 27; 28; 29; 30; 31; 32; 33; lct0_2; 34; lct0_6; 35; lct0_10; 36; lct0_14; 37; lct0_18; 38; lct0_22; 39; 40
- (in symbol A288_XP1, part D) XP1D; A288; 1; GND; 2; +1V8D; 3; tp0_23; 4; tp0_19; 5; tp0_15; 6; tp0_11; 7; tp0_7; 8; tp0_3; 9; 10; 11; 12; 13; 14; 15; 16; 17; 18; 19; 20; 21; 22; 23; 24; 25; 26; 27; 28; 29; 30; 31; 32; 33; lct0_3; 34; lct0_7; 35; lct0_11; 36; lct0_15; 37; lct0_19; 38; lct0_23; 39; 40
- (in symbol A288_XP2, part A) XP2A; A288; 1; GND; 2; +1V8D; 3; tp0_24; 4; tp0_28; 5; 6; 7; 8; 9; 10; \mx_oe; 11; tdi_ctrl; 12; ccb_brcst0; 13; brcst_str1; 14; seq_cmd0; 15; async_adb; 16; aff; 17; qlty1; 18; key3; 19; bxn0; 20; 21; 22; daq_d0; 23; daq_d3; 24; lct_specl; 25; jstate0; 26; feb0; 27; feb4; 28; TDI; 29; amu; 30; 31; 32; 33; 34; 35; 36; 37; tp1_28; 38; tp1_24; 39; 40
- (in symbol A288_XP2, part B) XP2B; A288; 1; GND; 2; +1V8D; 3; tp0_25; 4; tp0_29; 5; 6; 7; 8; 9; 10; test_pls; 11; tdo_ctrl; 12; ccb_brcst1; 13; dout_str; 14; seq_cmd1; 15; clock_en; 16; valid; 17; key0; 18; key4; 19; bxn1; 20; 21; +3V3D; 22; daq_d1; 23; daq_d4; 24; seq_sts0; 25; jstate1; 26; feb1; 27; feb5; 28; TCK; 29; invpat; 30; pretrig; 31; 32; 33; 34; 35; 36; 37; tp1_29; 38; tp1_25; 39; 40
- (in symbol A288_XP2, part C) XP2C; A288; 1; GND; 2; +3V3D; 3; tp0_26; 4; tp0_30; 5; 6; 7; tms_pgm; 8; tdi_pgm; 9; 10; 11; tms_ctrl; 12; ccb_brcst2; 13; ext_inj; 14; rsrvd_in0; 15; rsrvd_out0; 16; amu; 17; key1; 18; key5; 19; bxn2; 20; 21; 22; daq_d2; 23; daq_d5; 24; seq_sts1; 25; jstate2; 26; feb2; 27; feb6; 28; TMS; 29; halt; 30; slcl_done; 31; 32; 33; 34; 35; 36; 37; tp1_30; 38; tp1_26; 39; 40
- (in symbol A288_XP2, part D) XP2D; A288; 1; GND; 2; +3V3D; 3; tp0_27; 4; tp0_31; 5; 6; 7; tck_pgm; 8; tdo_pgm; 9; 10; tp_strt_ext; 11; tck_ctrl; 12; ccb_brcst3; 13; l1a; 14; rsrvd_in1; 15; rsrvd_out1; 16; qlty0; 17; key2; 18; key6; 19; 20; 21; clock; 22; 23; daq_d6; 24; ddu_spcl; 25; jstate3; 26; feb3; 27; TDO; 28; l1a_ok; 29; no_l1a; 30; 31; 32; 33; 34; \hard_rst; 35; 36; 37; tp1_31; 38; tp1_27; 39; 40
- (in symbol A288_XP3, part A) XP3A; A288; 1; GND; 2; +3V3D; 3; lct0_24; 4; lct0_28; 5; lct0_32; 6; lct0_36; 7; lct0_40; 8; lct0_44; 9; lct1_0; 10; lct1_4; 11; lct1_8; 12; lct1_12; 13; lct1_16; 14; lct1_20; 15; 16; 17; 18; 19; 20; clkout80; 21; clkout40; 22; 23; settst_dly; 24; din_dly; 25; 26; 27; lct1_24; 28; lct1_28; 29; lct1_32; 30; lct1_36; 31; lct1_40; 32; lct1_44; 33; lct2_0; 34; lct2_4; 35; lct2_8; 36; lct2_12; 37; lct2_16; 38; lct2_20; 39; 40
- (in symbol A288_XP3, part B) XP3B; A288; 1; GND; 2; +3V3D; 3; lct0_25; 4; lct0_29; 5; lct0_33; 6; lct0_37; 7; lct0_41; 8; lct0_45; 9; lct1_1; 10; lct1_5; 11; lct1_9; 12; lct1_13; 13; lct1_17; 14; lct1_21; 15; 16; 17; 18; 19; 20; 21; 22; 23; \rs_dly; 24; clk_dly; 25; 26; 27; lct1_25; 28; lct1_29; 29; lct1_33; 30; lct1_37; 31; lct1_41; 32; lct1_45; 33; lct2_1; 34; lct2_5; 35; lct2_9; 36; lct2_13; 37; lct2_17; 38; lct2_21; 39; 40
- (in symbol A288_XP3, part C) XP3C; A288; 1; GND; 2; +1V8D; 3; lct0_26; 4; lct0_30; 5; lct0_34; 6; lct0_38; 7; lct0_42; 8; lct0_46; 9; lct1_2; 10; lct1_6; 11; lct1_10; 12; lct1_14; 13; lct1_18; 14; lct1_22; 15; 16; 17; 18; 19; 20; 21; +3V3D; 22; 23; 24; 25; 26; 27; lct1_26; 28; lct1_30; 29; lct1_34; 30; lct1_38; 31; lct1_42; 32; lct1_46; 33; lct2_2; 34; lct2_6; 35; lct2_10; 36; lct2_14; 37; lct2_18; 38; lct2_22; 39; 40
- (in symbol A288_XP3, part D) XP3D; A288; 1; GND; 2; +1V8D; 3; lct0_27; 4; lct0_31; 5; lct0_35; 6; lct0_39; 7; lct0_43; 8; lct0_47; 9; lct1_3; 10; lct1_7; 11; lct1_11; 12; lct1_15; 13; lct1_19; 14; lct1_23; 15; 16; 17; 18; 19; 20; 21; 22; 23; 24; 25; 26; 27; lct1_27; 28; lct1_31; 29; lct1_35; 30; lct1_39; 31; lct1_43; 32; lct1_47; 33; lct2_3; 34; lct2_7; 35; lct2_11; 36; lct2_15; 37; lct2_19; 38; lct2_23; 39; 40
- (in symbol A288_XP4, part A) XP4A; A288; 1; GND; 2; +1V8D; 3; tp1_20; 4; tp1_16; 5; tp1_12; 6; tp1_8; 7; tp1_4; 8; tp1_0; 9; alct_sn; 10; 11; 12; 13; 14; 15; 16; 17; 18; 19; 20; 21; 22; 23; 24; 25; 26; 27; 28; 29; 30; 31; 32; 33; lct2_44; 34; lct2_40; 35; lct2_36; 36; lct2_32; 37; lct2_28; 38; lct2_24; 39; 40
- (in symbol A288_XP4, part B) XP4B; A288; 1; GND; 2; +1V8D; 3; tp1_21; 4; tp1_17; 5; tp1_13; 6; tp1_9; 7; tp1_5; 8; tp1_1; 9; 10; 11; 12; 13; 14; 15; 16; 17; 18; 19; 20; 21; +3V3D; 22; 23; 24; 25; 26; 27; 28; 29; 30; 31; 32; 33; lct2_45; 34; lct2_41; 35; lct2_37; 36; lct2_33; 37; lct2_29; 38; lct2_25; 39; 40
- (in symbol A288_XP4, part C) XP4C; A288; 1; GND; 2; +3V3D; 3; tp1_22; 4; tp1_18; 5; tp1_14; 6; tp1_10; 7; tp1_6; 8; tp1_2; 9; 10; 11; 12; 13; 14; 15; 16; 17; 18; 19; 20; 21; 22; 23; 24; 25; 26; 27; 28; 29; 30; 31; 32; 33; lct2_46; 34; lct2_42; 35; lct2_38; 36; lct2_34; 37; lct2_30; 38; lct2_26; 39; 40
- (in symbol A288_XP4, part D) XP4D; A288; 1; GND; 2; +3V3D; 3; tp1_23; 4; tp1_19; 5; tp1_15; 6; tp1_11; 7; tp1_7; 8; tp1_3; 9; 10; 11; 12; 13; 14; 15; 16; 17; 18; 19; 20; 21; 22; dout_dly2; 23; \cs_dly2; 24; 25; 26; 27; 28; 29; 30; 31; 32; 33; lct2_47; 34; lct2_43; 35; lct2_39; 36; lct2_35; 37; lct2_31; 38; lct2_27; 39; 40
- (in symbol A384_XP1, part A) XP1A; A384; 1; GND; 2; +3V3D; 3; tp0_20; 4; tp0_16; 5; tp0_12; 6; tp0_8; 7; tp0_4; 8; tp0_0; 9; 10; 11; 12; 13; 14; 15; 16; 17; 18; 19; 20; 21; 22; 23; 24; 25; 26; 27; 28; 29; lct0_0; 30; lct0_4; 31; lct0_8; 32; lct0_12; 33; lct0_16; 34; lct0_20; 35; lct0_24; 36; lct0_28; 37; lct0_32; 38; lct0_36; 39; 40
- (in symbol A384_XP1, part B) XP1B; A384; 1; GND; 2; +3V3D; 3; tp0_21; 4; tp0_17; 5; tp0_13; 6; tp0_9; 7; tp0_5; 8; tp0_1; 9; 10; 11; 12; 13; 14; 15; 16; 17; 18; 19; 20; 21; 22; 23; 24; 25; 26; 27; 28; 29; lct0_1; 30; lct0_5; 31; lct0_9; 32; lct0_13; 33; lct0_17; 34; lct0_21; 35; lct0_25; 36; lct0_29; 37; lct0_33; 38; lct0_37; 39; 40
- (in symbol A384_XP1, part C) XP1C; A384; 1; GND; 2; +1V8D; 3; tp0_22; 4; tp0_18; 5; tp0_14; 6; tp0_10; 7; tp0_6; 8; tp0_2; 9; 10; 11; 12; 13; 14; 15; 16; 17; 18; 19; 20; 21; +3V3D; 22; 23; 24; 25; 26; 27; 28; 29; lct0_2; 30; lct0_6; 31; lct0_10; 32; lct0_14; 33; lct0_18; 34; lct0_22; 35; lct0_26; 36; lct0_30; 37; lct0_34; 38; lct0_38; 39; 40
- (in symbol A384_XP1, part D) XP1D; A384; 1; GND; 2; +1V8D; 3; tp0_23; 4; tp0_19; 5; tp0_15; 6; tp0_11; 7; tp0_7; 8; tp0_3; 9; 10; 11; 12; 13; 14; 15; 16; 17; 18; 19; 20; 21; 22; 23; 24; 25; 26; 27; 28; 29; lct0_3; 30; lct0_7; 31; lct0_11; 32; lct0_15; 33; lct0_19; 34; lct0_23; 35; lct0_27; 36; lct0_31; 37; lct0_35; 38; lct0_39; 39; 40
- (in symbol A384_XP2, part A) XP2A; A384; 1; GND; 2; +1V8D; 3; tp0_24; 4; tp0_28; 5; 6; 7; 8; 9; 10; tck_ctrl; 11; ccb_brcst3; 12; l1a; 13; rsvrd_in1; 14; rsvrd_out1; 15; qlty0; 16; key2; 17; key6; 18; daq_d0; 19; daq_d3; 20; 21; 22; daq_d6; 23; ddu_spcl; 24; jstate1; 25; feb1; 26; feb5; 27; TCK; 28; invpat; 29; SN; 30; 31; 32; 33; 34; 35; 36; 37; tp1_28; 38; tp1_24; 39; 40
- (in symbol A384_XP2, part B) XP2B; A384; 1; GND; 2; +1V8D; 3; tp0_25; 4; tp0_29; 5; 6; 7; 8; 9; 10; tms_ctrl; 11; ccb_brcst2; 12; ext_inj; 13; rsvrd_in0; 14; rsvrd_out0; 15; amu; 16; key1; 17; key5; 18; bxn2; 19; daq_d2; 20; 21; +3V3D; 22; daq_d5; 23; seq_sts1; 24; jstate0; 25; feb0; 26; feb4; 27; TMS; 28; 29; pretrig; 30; 31; 32; 33; 34; 35; 36; 37; tp1_29; 38; tp1_25; 39; 40
- (in symbol A384_XP2, part C) XP2C; A384; 1; GND; 2; +3V3D; 3; tp0_26; 4; tp0_30; 5; 6; 7; tms_pgm; 8; tdi_pgm; 9; 10; tdo_ctrl; 11; ccb_brcst1; 12; dout_str; 13; seq_cmd1; 14; clock_en; 15; valid; 16; key0; 17; key4; 18; bxn1; 19; daq_d1; 20; 21; 22; daq_d4; 23; seq_sts0; 24; tp_strt_ext; 25; jstate3; 26; feb3; 27; TDO; 28; halt; 29; l1a_ok; 30; sl_cl_done; 31; 32; 33; 34; 35; 36; 37; tp1_30; 38; tp1_26; 39; 40
- (in symbol A384_XP2, part D) XP2D; A384; 1; GND; 2; +3V3D; 3; tp0_27; 4; tp0_31; 5; 6; 7; tck_pgm; 8; tdo_pgm; 9; 10; tdi_ctrl; 11; ccb_brcst0; 12; brcst_str1; 13; seq_cmd0; 14; async_adb; 15; aff; 16; qlty1; 17; key3; 18; bxn0; 19; 20; 21; clock; 22; 23; lct_spcl; 24; tst_psl; 25; jstate2; 26; feb2; 27; feb6; 28; TDI; 29; no_l1a; 30; 31; 32; 33; 34; \hard_rst; 35; 36; 37; tp1_31; 38; tp1_27; 39; 40
- (in symbol A384_XP3, part A) XP3A; A384; 1; GND; 2; +3V3D; 3; lct0_40; 4; lct0_44; 5; lct1_0; 6; lct1_4; 7; lct1_8; 8; lct1_12; 9; lct1_16; 10; lct1_20; 11; lct1_24; 12; lct1_28; 13; lct1_32; 14; lct1_36; 15; lct1_40; 16; lct1_44; 17; \cs_dly0; 18; \cs_dly1; 19; 20; clkout80; 21; clkout40; 22; 23; \cs_dly2; 24; \cs_dly3; 25; lct2_0; 26; lct2_4; 27; lct2_8; 28; lct2_12; 29; lct2_16; 30; lct2_20; 31; lct2_24; 32; lct2_28; 33; lct2_32; 34; lct2_36; 35; lct2_40; 36; lct2_44; 37; lct3_0; 38; lct3_4; 39; 40
- (in symbol A384_XP3, part B) XP3B; A384; 1; GND; 2; +3V3D; 3; lct0_41; 4; lct0_45; 5; lct1_1; 6; lct1_5; 7; lct1_9; 8; lct1_13; 9; lct1_17; 10; lct1_21; 11; lct1_25; 12; lct1_29; 13; lct1_33; 14; lct1_37; 15; lct1_41; 16; lct1_45; 17; dout_dly0; 18; dout_dly1; 19; din_dly; 20; 21; 22; settst_dly; 23; dout_dly2; 24; dout_dly3; 25; lct2_1; 26; lct2_5; 27; lct2_9; 28; lct2_13; 29; lct2_17; 30; lct2_21; 31; lct2_25; 32; lct2_29; 33; lct2_33; 34; lct2_37; 35; lct2_41; 36; lct2_45; 37; lct3_1; 38; lct3_5; 39; 40
- (in symbol A384_XP3, part C) XP3C; A384; 1; GND; 2; +1V8D; 3; lct0_42; 4; lct0_46; 5; lct1_2; 6; lct1_6; 7; lct1_10; 8; lct1_14; 9; lct1_18; 10; lct1_22; 11; lct1_26; 12; lct1_30; 13; lct1_34; 14; lct1_38; 15; lct1_42; 16; lct1_46; 17; 18; 19; clk_dly; 20; 21; +3V3D; 22; \rs_dly; 23; 24; 25; lct2_2; 26; lct2_6; 27; lct2_10; 28; lct2_14; 29; lct2_18; 30; lct2_22; 31; lct2_26; 32; lct2_30; 33; lct2_34; 34; lct2_38; 35; lct2_42; 36; lct2_46; 37; lct3_2; 38; lct3_6; 39; 40
- (in symbol A384_XP3, part D) XP3D; A384; 1; GND; 2; +1V8D; 3; lct0_43; 4; lct0_47; 5; lct1_3; 6; lct1_7; 7; lct1_11; 8; lct1_15; 9; lct1_19; 10; lct1_23; 11; lct1_27; 12; lct1_31; 13; lct1_35; 14; lct1_39; 15; lct1_43; 16; lct1_47; 17; 18; 19; \mx_oe; 20; 21; 22; 23; 24; 25; lct2_3; 26; lct2_7; 27; lct2_11; 28; lct2_15; 29; lct2_19; 30; lct2_23; 31; lct2_27; 32; lct2_31; 33; lct2_35; 34; lct2_39; 35; lct2_43; 36; lct2_47; 37; lct3_3; 38; lct3_7; 39; 40
- (in symbol A384_XP4, part A) XP4A; A384; 1; GND; 2; +1V8D; 3; tp1_20; 4; tp1_16; 5; tp1_12; 6; tp1_8; 7; tp1_4; 8; tp1_0; 9; 10; 11; 12; 13; 14; 15; 16; 17; 18; 19; 20; 21; 22; 23; 24; 25; 26; 27; 28; 29; lct3_47; 30; lct3_43; 31; lct3_39; 32; lct3_35; 33; lct3_31; 34; lct3_27; 35; lct3_23; 36; lct3_19; 37; lct3_15; 38; lct3_11; 39; 40
- (in symbol A384_XP4, part B) XP4B; A384; 1; GND; 2; +1V8D; 3; tp1_21; 4; tp1_17; 5; tp1_13; 6; tp1_9; 7; tp1_5; 8; tp1_1; 9; 10; 11; 12; 13; 14; 15; 16; 17; 18; 19; 20; 21; +3V3D; 22; 23; 24; 25; 26; 27; 28; 29; lct3_46; 30; lct3_42; 31; lct2_38; 32; lct2_34; 33; lct2_30; 34; lct2_26; 35; lct2_22; 36; lct2_18; 37; lct2_14; 38; lct2_10; 39; 40
- (in symbol A384_XP4, part C) XP4C; A384; 1; GND; 2; +3V3D; 3; tp1_22; 4; tp1_18; 5; tp1_14; 6; tp1_10; 7; tp1_6; 8; tp1_2; 9; 10; 11; 12; 13; 14; 15; 16; 17; 18; 19; 20; 21; 22; 23; 24; 25; 26; 27; 28; 29; lct3_45; 30; lct3_41; 31; lct2_37; 32; lct2_33; 33; lct2_29; 34; lct2_25; 35; lct2_21; 36; lct2_17; 37; lct2_13; 38; lct2_9; 39; 40
- (in symbol A384_XP4, part D) XP4D; A384; 1; GND; 2; +3V3D; 3; tp1_23; 4; tp1_19; 5; tp1_15; 6; tp1_11; 7; tp1_7; 8; tp1_3; 9; 10; 11; 12; 13; 14; 15; 16; 17; 18; 19; 20; 21; 22; 23; 24; 25; 26; 27; 28; 29; lct3_44; 30; lct3_40; 31; lct2_36; 32; lct2_32; 33; lct2_28; 34; lct2_24; 35; lct2_20; 36; lct2_16; 37; lct2_12; 38; lct2_8; 39; 40
- (in symbol A672_XP1, part A) XP1A; A672; 1; GND; 2; +3V3D; 3; tp0_20; 4; tp0_16; 5; tp0_12; 6; tp0_8; 7; tp0_4; 8; tp0_0; 9; dout_dly0; 10; /cs_dly0; 11; lct0_0; 12; lct0_4; 13; lct0_8; 14; lct0_12; 15; lct0_16; 16; lct0_20; 17; lct0_24; 18; lct0_28; 19; lct0_32; 20; 21; 22; lct0_36; 23; lct0_40; 24; lct0_44; 25; lct1_0; 26; lct1_4; 27; lct1_8; 28; lct1_12; 29; lct1_16; 30; lct1_20; 31; lct1_24; 32; lct1_28; 33; lct1_32; 34; lct1_36; 35; lct1_40; 36; lct1_44; 37; lct2_0; 38; lct2_4; 39; 40
- (in symbol A672_XP1, part B) XP1B; A672; 1; GND; 2; +3V3D; 3; tp0_21; 4; tp0_17; 5; tp0_13; 6; tp0_9; 7; tp0_5; 8; tp0_1; 9; dout_dly1; 10; /cs_dly1; 11; lct0_1; 12; lct0_5; 13; lct0_9; 14; lct0_13; 15; lct0_17; 16; lct0_21; 17; lct0_25; 18; lct0_29; 19; lct0_33; 20; 21; 22; lct0_37; 23; lct0_41; 24; lct0_45; 25; lct1_1; 26; lct1_5; 27; lct1_9; 28; lct1_13; 29; lct1_17; 30; lct1_21; 31; lct1_25; 32; lct1_29; 33; lct1_33; 34; lct1_37; 35; lct1_41; 36; lct1_45; 37; lct2_1; 38; lct2_5; 39; 40
- (in symbol A672_XP1, part C) XP1C; A672; 1; GND; 2; +1V8D; 3; tp0_22; 4; tp0_18; 5; tp0_14; 6; tp0_10; 7; tp0_6; 8; tp0_2; 9; dout_dly2; 10; /cs_dly2; 11; lct0_2; 12; lct0_6; 13; lct0_10; 14; lct0_14; 15; lct0_18; 16; lct0_22; 17; lct0_26; 18; lct0_30; 19; lct0_34; 20; 21; +3V3D; 22; lct0_38; 23; lct0_42; 24; lct0_46; 25; lct1_2; 26; lct1_6; 27; lct1_10; 28; lct1_14; 29; lct1_18; 30; lct1_22; 31; lct1_26; 32; lct1_30; 33; lct1_34; 34; lct1_38; 35; lct1_42; 36; lct1_46; 37; lct2_2; 38; lct2_6; 39; 40
- (in symbol A672_XP1, part D) XP1D; A672; 1; GND; 2; +1V8D; 3; tp0_23; 4; tp0_19; 5; tp0_15; 6; tp0_11; 7; tp0_7; 8; tp0_3; 9; dout_dly3; 10; /cs_dly3; 11; lct0_3; 12; lct0_7; 13; lct0_11; 14; lct0_15; 15; lct0_19; 16; lct0_23; 17; lct0_27; 18; lct0_31; 19; lct0_35; 20; 21; 22; lct0_39; 23; lct0_43; 24; lct0_47; 25; lct1_3; 26; lct1_7; 27; lct1_11; 28; lct1_15; 29; lct1_19; 30; lct1_23; 31; lct1_27; 32; lct1_31; 33; lct1_35; 34; lct1_39; 35; lct1_43; 36; lct1_47; 37; lct2_3; 38; lct2_7; 39; 40
- (in symbol A672_XP2, part A) XP2A; A672; 1; GND; 2; +1V8D; 3; tp0_24; 4; tp0_28; 5; 6; 7; 8; 9; 10; \mx_oe; 11; tdi_ctrl; 12; ccb_brcst0; 13; brcst_str1; 14; seq_cmd0; 15; async_adb; 16; aff; 17; qlty1; 18; key3; 19; bxn0; 20; 21; 22; daq_d0; 23; daq_d3; 24; lct_specl; 25; jstate0; 26; feb0; 27; feb4; 28; TDI; 29; amu; 30; 31; 32; 33; 34; 35; 36; 37; tp1_28; 38; tp1_24; 39; 40
- (in symbol A672_XP2, part B) XP2B; A672; 1; GND; 2; +1V8D; 3; tp0_25; 4; tp0_29; 5; 6; 7; 8; 9; 10; test_pls; 11; tdo_ctrl; 12; ccb_brcst1; 13; dout_str; 14; seq_cmd1; 15; clock_en; 16; valid; 17; key0; 18; key4; 19; bxn1; 20; 21; +3V3D; 22; daq_d1; 23; daq_d4; 24; seq_sts0; 25; jstate1; 26; feb1; 27; feb5; 28; TCK; 29; invpat; 30; pretrig; 31; 32; 33; 34; 35; 36; 37; tp1_29; 38; tp1_25; 39; 40
- (in symbol A672_XP2, part C) XP2C; A672; 1; GND; 2; +3V3D; 3; tp0_26; 4; tp0_30; 5; 6; 7; tms_pgm; 8; tdi_pgm; 9; 10; 11; tms_ctrl; 12; ccb_brcst2; 13; ext_inj; 14; rsrvd_in0; 15; rsrvd_out0; 16; amu; 17; key1; 18; key5; 19; bxn2; 20; 21; 22; daq_d2; 23; daq_d5; 24; seq_sts1; 25; jstate2; 26; feb2; 27; feb6; 28; TMS; 29; halt; 30; slcl_done; 31; 32; 33; 34; 35; 36; 37; tp1_30; 38; tp1_26; 39; 40
- (in symbol A672_XP2, part D) XP2D; A672; 1; GND; 2; +3V3D; 3; tp0_27; 4; tp0_31; 5; 6; 7; tck_pgm; 8; tdo_pgm; 9; 10; tp_strt_ext; 11; tck_ctrl; 12; ccb_brcst3; 13; l1a; 14; rsrvd_in1; 15; rsrvd_out1; 16; qlty0; 17; key2; 18; key6; 19; 20; 21; clock; 22; 23; daq_d6; 24; ddu_spcl; 25; jstate3; 26; feb3; 27; TDO; 28; l1a_ok; 29; no_l1a; 30; 31; 32; 33; 34; \hard_rst; 35; 36; 37; tp1_31; 38; tp1_27; 39; 40
- (in symbol A672_XP3, part A) XP3A; A672; 1; GND; 2; +3V3D; 3; lct2_8; 4; lct2_12; 5; lct2_16; 6; lct2_20; 7; lct2_24; 8; lct2_28; 9; lct2_32; 10; lct2_36; 11; lct2_40; 12; lct2_44; 13; lct3_0; 14; lct3_4; 15; lct3_8; 16; lct3_12; 17; lct3_16; 18; lct3_20; 19; 20; clkout80; 21; clkout40; 22; 23; lct3_24; 24; lct3_28; 25; lct3_32; 26; lct3_36; 27; lct3_40; 28; lct3_44; 29; lct4_0; 30; lct4_4; 31; lct4_8; 32; lct4_12; 33; lct4_16; 34; lct4_20; 35; lct4_24; 36; lct4_28; 37; lct4_32; 38; lct4_36; 39; 40
- (in symbol A672_XP3, part B) XP3B; A672; 1; GND; 2; +3V3D; 3; lct2_9; 4; lct2_13; 5; lct2_17; 6; lct2_21; 7; lct2_25; 8; lct2_29; 9; lct2_33; 10; lct2_37; 11; lct2_41; 12; lct2_45; 13; lct3_1; 14; lct3_5; 15; lct3_8; 16; lct3_13; 17; lct3_17; 18; lct3_21; 19; 20; clkout80_1; 21; clkout40_1; 22; 23; lct3_25; 24; lct3_29; 25; lct3_33; 26; lct3_37; 27; lct3_41; 28; lct3_45; 29; lct4_1; 30; lct4_5; 31; lct4_9; 32; lct4_13; 33; lct4_17; 34; lct4_21; 35; lct4_25; 36; lct4_29; 37; lct4_33; 38; lct4_37; 39; 40
- (in symbol A672_XP3, part C) XP3C; A672; 1; GND; 2; +1V8D; 3; lct2_10; 4; lct2_14; 5; lct2_18; 6; lct2_22; 7; lct2_26; 8; lct2_30; 9; lct2_34; 10; lct2_38; 11; lct2_42; 12; lct2_46; 13; lct3_2; 14; lct3_6; 15; lct3_10; 16; lct3_14; 17; lct3_18; 18; lct3_22; 19; din_dly; 20; 21; +3V3D; 22; settest_dly; 23; lct3_26; 24; lct3_30; 25; lct3_34; 26; lct3_38; 27; lct3_42; 28; lct3_46; 29; lct4_2; 30; lct4_6; 31; lct4_10; 32; lct4_14; 33; lct4_18; 34; lct4_22; 35; lct4_26; 36; lct4_30; 37; lct4_34; 38; lct4_38; 39; 40
- (in symbol A672_XP3, part D) XP3D; A672; 1; GND; 2; +1V8D; 3; lct2_11; 4; lct2_15; 5; lct2_19; 6; lct2_23; 7; lct2_27; 8; lct2_31; 9; lct2_35; 10; lct2_39; 11; lct2_43; 12; lct2_47; 13; lct3_3; 14; lct3_7; 15; lct3_11; 16; lct3_15; 17; lct3_19; 18; lct3_23; 19; clk_dly; 20; 21; 22; \rs_dly; 23; lct3_27; 24; lct3_31; 25; lct3_35; 26; lct3_39; 27; lct3_43; 28; lct3_47; 29; lct4_3; 30; lct4_7; 31; lct4_11; 32; lct4_15; 33; lct4_19; 34; lct4_23; 35; lct4_27; 36; lct4_31; 37; lct4_35; 38; lct4_39; 39; 40
- (in symbol A672_XP4, part A) XP4A; A672; 1; GND; 2; +1V8D; 3; tp1_20; 4; tp1_16; 5; tp1_12; 6; tp1_8; 7; tp1_4; 8; tp1_0; 9; alct_sn; 10; 11; lct6_44; 12; lct6_40; 13; lct6_36; 14; lct6_32; 15; lct6_28; 16; lct6_24; 17; lct6_20; 18; lct6_16; 19; lct6_12; 20; 21; 22; lct6_8; 23; lct6_4; 24; lct6_0; 25; lct5_44; 26; lct5_40; 27; lct5_36; 28; lct5_32; 29; lct5_28; 30; lct5_24; 31; lct5_20; 32; lct5_16; 33; lct5_12; 34; lct5_8; 35; lct5_4; 36; lct5_0; 37; lct4_44; 38; lct4_40; 39; 40
- (in symbol A672_XP4, part B) XP4A; A672; 1; GND; 2; +1V8D; 3; tp1_21; 4; tp1_17; 5; tp1_13; 6; tp1_9; 7; tp1_5; 8; tp1_1; 9; dout_dly6; 10; \cs_dly6; 11; lct6_45; 12; lct6_41; 13; lct6_37; 14; lct6_33; 15; lct6_29; 16; lct6_25; 17; lct6_21; 18; lct6_17; 19; lct6_13; 20; 21; +3V3D; 22; lct6_9; 23; lct6_5; 24; lct6_1; 25; lct5_45; 26; lct5_41; 27; lct5_37; 28; lct5_33; 29; lct5_29; 30; lct5_25; 31; lct5_21; 32; lct5_17; 33; lct5_13; 34; lct5_9; 35; lct5_5; 36; lct5_1; 37; lct4_45; 38; lct4_41; 39; 40
- (in symbol A672_XP4, part C) XP4C; A672; 1; GND; 2; +3V3D; 3; tp1_22; 4; tp1_18; 5; tp1_14; 6; tp1_10; 7; tp1_6; 8; tp1_2; 9; dout_dly5; 10; \cs_dly5; 11; lct6_46; 12; lct6_42; 13; lct6_38; 14; lct6_34; 15; lct6_30; 16; lct6_26; 17; lct6_22; 18; lct6_18; 19; lct6_14; 20; 21; 22; lct6_10; 23; lct6_6; 24; lct6_2; 25; lct5_46; 26; lct5_42; 27; lct5_38; 28; lct5_34; 29; lct5_30; 30; lct5_26; 31; lct5_22; 32; lct5_18; 33; lct5_14; 34; lct5_10; 35; lct5_6; 36; lct5_2; 37; lct4_46; 38; lct4_42; 39; 40
- (in symbol A672_XP4, part D) XP4D; A672; 1; GND; 2; +3V3D; 3; tp1_23; 4; tp1_19; 5; tp1_15; 6; tp1_11; 7; tp1_7; 8; tp1_3; 9; dout_dly4; 10; \cs_dly4; 11; lct6_47; 12; lct6_43; 13; lct6_39; 14; lct6_35; 15; lct6_31; 16; lct6_27; 17; lct6_23; 18; lct6_19; 19; lct6_15; 20; 21; 22; lct6_11; 23; lct6_7; 24; lct6_3; 25; lct5_47; 26; lct5_43; 27; lct5_39; 28; lct5_35; 29; lct5_31; 30; lct5_27; 31; lct5_23; 32; lct5_19; 33; lct5_15; 34; lct5_11; 35; lct5_7; 36; lct5_3; 37; lct4_47; 38; lct4_43; 39; 40
- (in symbol GRM188R6YA475KE15D) .
- (in symbol Samtec_XP1, part A) XP1A
- (in symbol Samtec_XP1, part B) XP1B
- (in symbol Samtec_XP1, part C) XP1C
- (in symbol Samtec_XP1, part D) XP1D
- (in symbol Samtec_XP2, part A) XP2A
- (in symbol Samtec_XP2, part B) XP2B
- (in symbol Samtec_XP2, part C) XP2C
- (in symbol Samtec_XP2, part D) XP2D
- (in symbol Samtec_XP3, part A) XP3A
- (in symbol Samtec_XP3, part B) XP3B
- (in symbol Samtec_XP3, part C) XP3C
- (in symbol Samtec_XP3, part D) XP3D
- (in symbol Samtec_XP4, part A) XP4A
- (in symbol Samtec_XP4, part B) XP4B
- (in symbol Samtec_XP4, part C) XP4C
- (in symbol Samtec_XP4, part D) XP4D

### Library data of the parts
C120-C132 C134-C144 = GRM188R6YA475KE15D: CAP CER 4.7UF 35V X5R 0603; Manufacturer: Murata; Product Training Modules: High-Cap Multilayer Ceramic Capacitors; Featured Product: GA3 Safety Recognized Capacitors; EDA / CAD Models: Download from Accelerated Designs; Capacitance: 4.7µF; Tolerance: ±10%; Online Catalog: GRM Series; Other Names: 490-7205-2; Supplier 1: Digikey; Manufacturer Part Number: GRM188R6YA475KE15D; Stock 1: 180441; Pricing 1: 1=0.32, 10=0.264, 50=0.1486, 100=0.132, 250=0.099, 500=0.0875, 1000=0.0776 (USD); Standard Package: 4,000; Category: Capacitors; Family: Ceramic Capacitors; Series: GRM; Packaging: Tape & Reel (TR); Temperature Coefficient: X5R; Mounting Type: Surface Mount, MLCC; Operating Temperature: -55°C ~ 85°C; Applications: General Purpose; Package / Case: 0603 (1608 Metric); Size / Dimension: 0.063" L x 0.031" W (1.60mm x 0.80mm); Thickness (Max): 0.031" (0.80mm); ComponentLink1URL: https://datasheet.ciiva.com/46444/1769893-46444984.pdf; ComponentLink1Description: https://datasheet.ciiva.com/46444/1769893-46444984.pdf; ComponentLink2URL: https://datasheet.ciiva.com/46444/1769893-46444985.pdf; ComponentLink2Description: https://datasheet.ciiva.com/46444/1769893-46444985.pdf; ComponentLink3URL: https://datasheet.ciiva.com/14906/partnumbering-e-01-14906426.pdf; ComponentLink3Description: https://datasheet.ciiva.com/14906/partnumbering-e-01-14906426.pdf; ComponentLink4URL: https://datasheet.ciiva.com/14906/partnumbering-e-01-14906427.pdf; ComponentLink4Description: https://datasheet.ciiva.com/14906/partnumbering-e-01-14906427.pdf; ComponentLink5URL: https://datasheet.ciiva.com/14906/partnumbering-e-01-14906428.pdf; ComponentLink5Description: https://datasheet.ciiva.com/14906/partnumbering-e-01-14906428.pdf; Supplier 2: Digikey; Stock 2: 180441; Pricing 2: 1=0.32, 10=0.264, 50=0.1486, 100=0.132, 250=0.099, 500=0.0875, 1000=0.0776 (USD); Supplier Part Number 1: 490-7205-1-ND; Supplier Part Number 2: 490-7205-6-ND
XP1 = Samtec_XP1: Manufacturer Part Number: MOLC-140-01-L-Q-LC; mfgr_id: MOLC-140-01-S-Q-LC; mfgr: Samtec; mfgr_foot: 40x4; COMPROT: 180; COMPGROUP: 0; COMPSIDE: TOP; Contact Termination Type: Through Hole; Gender: Header; No. of Contacts: 160; No. of Rows: 4; Pitch Spacing: 1.27; Product Range: MOLC Series; SVHC: No SVHC (12-Jan-2017; Package: XP1; ComponentLink1Description: http://www.farnell.com/cad/2261282.pdf; ComponentLink1URL: http://www.farnell.com/cad/2261282.pdf; ComponentLink2Description: http://www.farnell.com/datasheets/2261038.pdf; ComponentLink2URL: http://www.farnell.com/datasheets/2261038.pdf; Contact Material: Phosphor Bronze; Contact Plating: Gold Plated Contacts; Manufacturer: SAMTEC; Pricing 1: 1=18.16, 3=17.11, 5=16.18, 10=15.35, 15=14.96, 25=14.34 (GBP); RoHS: YES; Stock 1: 0; Supplier 1: Farnell; Supplier Part Number 1: 2732055
XP2 = Samtec_XP2: Manufacturer Part Number: MOLC-140-01-L-Q-LC; mfgr_foot: 40x4; mfgr: Samtec; mfgr_id: MOLC-140-01-S-Q-LC; COMPROT: 270; COMPGROUP: 0; COMPSIDE: TOP; Contact Termination Type: Through Hole; Gender: Header; No. of Contacts: 160; No. of Rows: 4; Pitch Spacing: 1.27; Product Range: MOLC Series; SVHC: No SVHC (12-Jan-2017; Package: XP2; ComponentLink1Description: http://www.farnell.com/cad/2261282.pdf; ComponentLink1URL: http://www.farnell.com/cad/2261282.pdf; ComponentLink2Description: http://www.farnell.com/datasheets/2261038.pdf; ComponentLink2URL: http://www.farnell.com/datasheets/2261038.pdf; Contact Material: Phosphor Bronze; Contact Plating: Gold Plated Contacts; Manufacturer: SAMTEC; Pricing 1: 1=18.16, 3=17.11, 5=16.18, 10=15.35, 15=14.96, 25=14.34 (GBP); RoHS: YES; Stock 1: 0; Supplier 1: Farnell; Supplier Part Number 1: 2732055
XP3 = Samtec_XP3: Manufacturer Part Number: MOLC-140-01-L-Q-LC; mfgr_id: MOLC-140-01-S-Q-LC; mfgr: Samtec; mfgr_foot: 40x4; COMPROT: 270; COMPGROUP: 0; COMPSIDE: TOP; Contact Termination Type: Through Hole; Gender: Header; No. of Contacts: 160; No. of Rows: 4; Pitch Spacing: 1.27; Product Range: MOLC Series; SVHC: No SVHC (12-Jan-2017; Package: XP3; ComponentLink1Description: http://www.farnell.com/cad/2261282.pdf; ComponentLink1URL: http://www.farnell.com/cad/2261282.pdf; ComponentLink2Description: http://www.farnell.com/datasheets/2261038.pdf; ComponentLink2URL: http://www.farnell.com/datasheets/2261038.pdf; Contact Material: Phosphor Bronze; Contact Plating: Gold Plated Contacts; Manufacturer: SAMTEC; Pricing 1: 1=18.16, 3=17.11, 5=16.18, 10=15.35, 15=14.96, 25=14.34 (GBP); RoHS: YES; Stock 1: 0; Supplier 1: Farnell; Supplier Part Number 1: 2732055
XP4 = Samtec_XP4: Manufacturer Part Number: MOLC-140-01-L-Q-LC; mfgr_id: MOLC-140-01-S-Q-LC; mfgr: Samtec; mfgr_foot: 40x4; COMPROT: 180; COMPGROUP: 0; COMPSIDE: TOP; Contact Termination Type: Through Hole; Gender: Header; No. of Contacts: 160; No. of Rows: 4; Pitch Spacing: 1.27; Product Range: MOLC Series; SVHC: No SVHC (12-Jan-2017; Package: XP4; ComponentLink1Description: http://www.farnell.com/cad/2261282.pdf; ComponentLink1URL: http://www.farnell.com/cad/2261282.pdf; ComponentLink2Description: http://www.farnell.com/datasheets/2261038.pdf; ComponentLink2URL: http://www.farnell.com/datasheets/2261038.pdf; Contact Material: Phosphor Bronze; Contact Plating: Gold Plated Contacts; Manufacturer: SAMTEC; Pricing 1: 1=18.16, 3=17.11, 5=16.18, 10=15.35, 15=14.96, 25=14.34 (GBP); RoHS: YES; Stock 1: 0; Supplier 1: Farnell; Supplier Part Number 1: 2732055
XP?#1 XP?#4 XP?#7 XP?#10 = A288_XP1: mfgr_id: MOLC-140-01-S-Q-LC; mfgr: Samtec; mfgr_foot: 40x4; COMPROT: 180; COMPGROUP: 0; COMPSIDE: TOP; Package: XP1
XP?#2 XP?#5 XP?#8 XP?#11 = A384_XP1: mfgr_id: MOLC-140-01-S-Q-LC; mfgr: Samtec; mfgr_foot: 40x4; COMPROT: 180; COMPGROUP: 0; COMPSIDE: TOP; Package: XP1
XP?#3 XP?#6 XP?#9 XP?#12 = A672_XP1: mfgr_id: MOLC-140-01-S-Q-LC; mfgr: Samtec; mfgr_foot: 40x4; COMPROT: 180; COMPGROUP: 0; COMPSIDE: TOP; Package: XP1
XP?#13 XP?#16 XP?#19 XP?#22 = A288_XP2: mfgr_id: MOLC-140-01-S-Q-LC; mfgr: Samtec; mfgr_foot: 40x4; COMPROT: 180; COMPGROUP: 0; COMPSIDE: TOP; Package: XP2
XP?#14 XP?#17 XP?#20 XP?#23 = A384_XP2: mfgr_id: MOLC-140-01-S-Q-LC; mfgr: Samtec; mfgr_foot: 40x4; COMPROT: 180; COMPGROUP: 0; COMPSIDE: TOP; Package: XP2
XP?#15 XP?#18 XP?#21 XP?#24 = A672_XP2: mfgr_id: MOLC-140-01-S-Q-LC; mfgr: Samtec; mfgr_foot: 40x4; COMPROT: 180; COMPGROUP: 0; COMPSIDE: TOP; Package: XP2
XP?#25 XP?#28 XP?#31 XP?#34 = A288_XP3: mfgr_id: MOLC-140-01-S-Q-LC; mfgr: Samtec; mfgr_foot: 40x4; COMPROT: 180; COMPGROUP: 0; COMPSIDE: TOP; Package: XP3
XP?#26 XP?#29 XP?#32 XP?#35 = A384_XP3: mfgr_id: MOLC-140-01-S-Q-LC; mfgr: Samtec; mfgr_foot: 40x4; COMPROT: 180; COMPGROUP: 0; COMPSIDE: TOP; Package: XP3
XP?#27 XP?#30 XP?#33 XP?#36 = A672_XP3: mfgr_id: MOLC-140-01-S-Q-LC; mfgr: Samtec; mfgr_foot: 40x4; COMPROT: 180; COMPGROUP: 0; COMPSIDE: TOP; Package: XP3
XP?#37 XP?#40 XP?#43 XP?#46 = A288_XP4: mfgr_id: MOLC-140-01-S-Q-LC; mfgr: Samtec; mfgr_foot: 40x4; COMPROT: 180; COMPGROUP: 0; COMPSIDE: TOP; Package: XP4
XP?#38 XP?#41 XP?#44 XP?#47 = A384_XP4: mfgr_id: MOLC-140-01-S-Q-LC; mfgr: Samtec; mfgr_foot: 40x4; COMPROT: 180; COMPGROUP: 0; COMPSIDE: TOP; Package: XP4
XP?#39 XP?#42 XP?#45 XP?#48 = A672_XP4: mfgr_id: MOLC-140-01-S-Q-LC; mfgr: Samtec; mfgr_foot: 40x4; COMPROT: 180; COMPGROUP: 0; COMPSIDE: TOP; Package: XP4